# EAGLE design OpenBook (EAGLE 9.7.0)
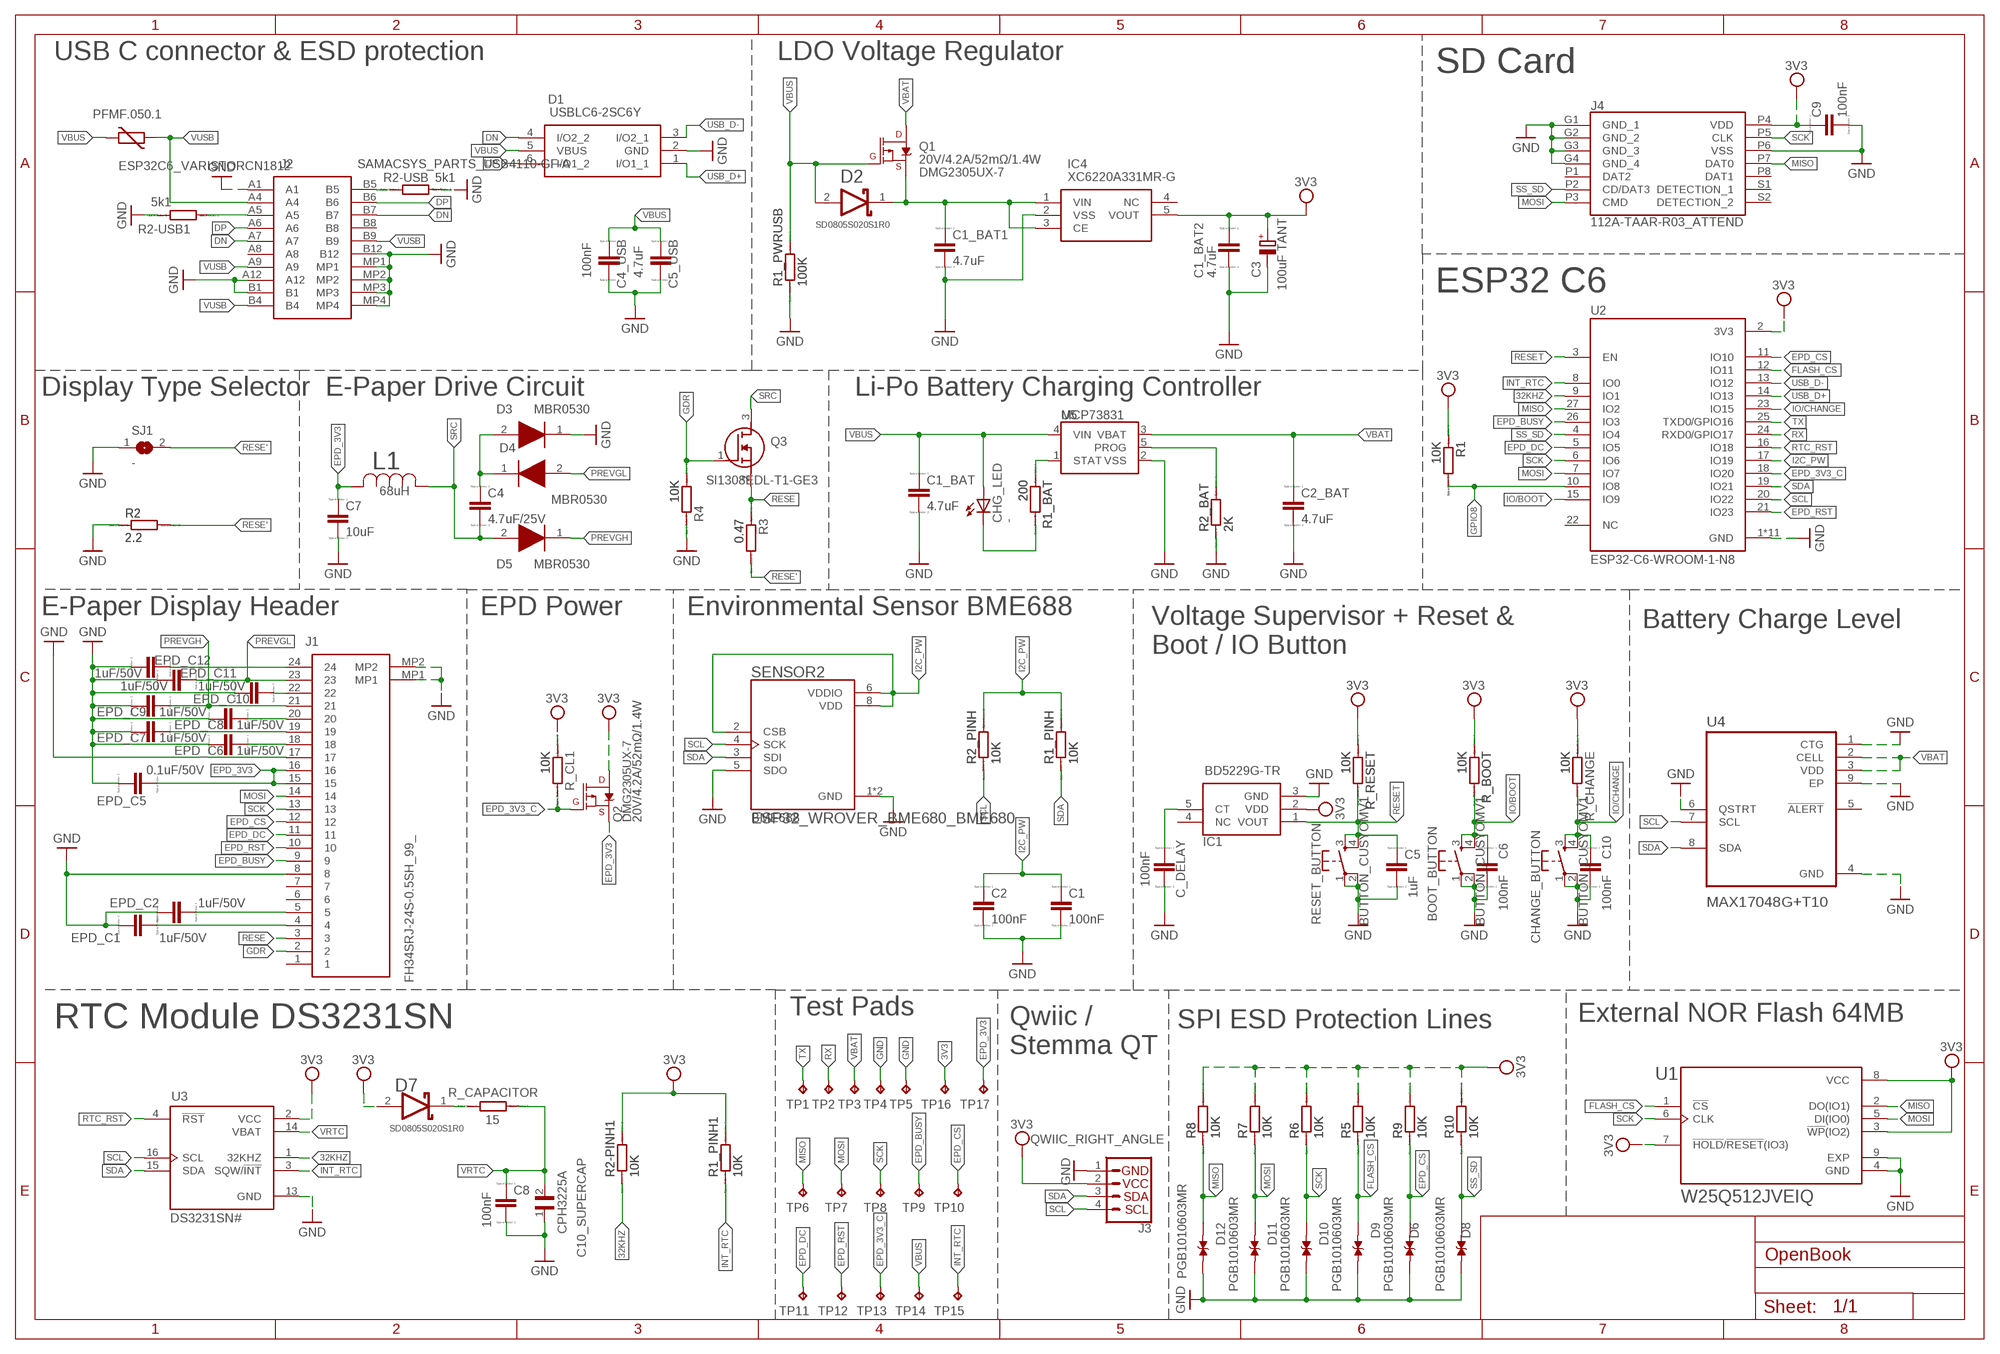
[diagram p0: schematic, sheet 1]

## Parts
BOOT_BUTTON  BUTTON_CUSYOMV1  [MYBUTTON]
C1  100nF  EAGLE-LTSPICE_CC0402  [EAGLE-LTSPICE_C0402]
C1_BAT  4.7uF  EAGLE-LTSPICE_CC0402  [EAGLE-LTSPICE_C0402]
C1_BAT1  4.7uF  EAGLE-LTSPICE_CC0402  [EAGLE-LTSPICE_C0402]
C1_BAT2  4.7uF  EAGLE-LTSPICE_CC0402  [EAGLE-LTSPICE_C0402]
C2  100nF  EAGLE-LTSPICE_CC0402  [EAGLE-LTSPICE_C0402]
C2_BAT  4.7uF  EAGLE-LTSPICE_CC0402  [EAGLE-LTSPICE_C0402]
C3  100uF TANT  RCL_CPOL-EUCT3528  [RCL_CT3528]
C4  4.7uF/25V  EAGLE-LTSPICE_CC0402  [EAGLE-LTSPICE_C0402]
C4_USB  100nF  EAGLE-LTSPICE_CC0402  [EAGLE-LTSPICE_C0402]
C5  1uF  EAGLE-LTSPICE_CC0402  [EAGLE-LTSPICE_C0402]
C5_USB  4.7uF  EAGLE-LTSPICE_CC0402  [EAGLE-LTSPICE_C0402]
C6  100nF  EAGLE-LTSPICE_CC0402  [EAGLE-LTSPICE_C0402]
C7  10uF  EAGLE-LTSPICE_CC0402  [EAGLE-LTSPICE_C0402]
C8  100nF  EAGLE-LTSPICE_CC0402  [EAGLE-LTSPICE_C0402]
C9  100nF  EAGLE-LTSPICE_CC0402  [EAGLE-LTSPICE_C0402]
C10  100nF  EAGLE-LTSPICE_CC0402  [EAGLE-LTSPICE_C0402]
C10_SUPERCAP  CPH3225A  [CAPCP3225X100N]
C_DELAY  100nF  EAGLE-LTSPICE_CC0402  [EAGLE-LTSPICE_C0402]
CHANGE_BUTTON  BUTTON_CUSYOMV1  [MYBUTTON]
CHG_LED  -  ADAFRUIT_LEDCHIP-LED0603  [ADAFRUIT_CHIP-LED0603]
D1  USBLC6-2SC6Y  [SOT95P280X145-6N]
D2  SD0805S020S1R0  ESP32_WROVER_AVX---SD0805S020S1R0_AVX_SD0805S020S1R0_0_0AVX_SD0805S020S1R0_0_0  [ESP32_WROVER_AVX---SD0805S020S1R0_AVX_SD0805S020S1R0_0]
D3  MBR0530  [SOD3716X135N]
D4  MBR0530  [SOD3716X135N]
D5  MBR0530  [SOD3716X135N]
D6  PGB1010603MR  [DIOC1608X36N]
D7  ESP32_WROVER_AVX---SD0805S020S1R0_AVX_SD0805S020S1R0_0_0AVX_SD0805S020S1R0_0_0  [ESP32_WROVER_AVX---SD0805S020S1R0_AVX_SD0805S020S1R0_0]
D8  PGB1010603MR  [DIOC1608X36N]
D9  PGB1010603MR  [DIOC1608X36N]
D10  PGB1010603MR  [DIOC1608X36N]
D11  PGB1010603MR  [DIOC1608X36N]
D12  PGB1010603MR  [DIOC1608X36N]
EPD_C1  1uF/50V  EAGLE-LTSPICE_CC0402  [EAGLE-LTSPICE_C0402]
EPD_C2  1uF/50V  EAGLE-LTSPICE_CC0402  [EAGLE-LTSPICE_C0402]
EPD_C5  0.1uF/50V  EAGLE-LTSPICE_CC0402  [EAGLE-LTSPICE_C0402]
EPD_C6  1uF/50V  EAGLE-LTSPICE_CC0402  [EAGLE-LTSPICE_C0402]
EPD_C7  1uF/50V  EAGLE-LTSPICE_CC0402  [EAGLE-LTSPICE_C0402]
EPD_C8  1uF/50V  EAGLE-LTSPICE_CC0402  [EAGLE-LTSPICE_C0402]
EPD_C9  1uF/50V  EAGLE-LTSPICE_CC0402  [EAGLE-LTSPICE_C0402]
EPD_C10  1uF/50V  EAGLE-LTSPICE_CC0402  [EAGLE-LTSPICE_C0402]
EPD_C11  1uF/50V  EAGLE-LTSPICE_CC0402  [EAGLE-LTSPICE_C0402]
EPD_C12  1uF/50V  EAGLE-LTSPICE_CC0402  [EAGLE-LTSPICE_C0402]
IC1  BD5229G-TR  [SOT95P280X125-5N]
IC4  XC6220A331MR-G  [SOT95P280X120-5N]
J1  FH34SRJ-24S-0.5SH_99_  [FH34SRJ24S05SH99]
J2  SAMACSYS_PARTS_USB4110-GF-A  [SAMACSYS_PARTS_USB4110GFA]
J3  QWIIC_RIGHT_ANGLE  QWIIC_CONNECTORJS-1MM  [JST04_1MM_RA]
J4  112A-TAAR-R03_ATTEND  [112ATAARR03ATTEND]
L1  68uH  744043680IND_4828-WE-TPC_WRE  [IND_4828-WE-TPC_WRE]
PFMF.050.1  ESP32C6_VARISTORCN1812  [ESP32C6_VARISTOR_CT/CN1812]
Q1  20V/4.2A/52mΩ/1.4W  ESP32_WROVER_SPARKFUN-DISCRETESEMI_MOSFET_PCH-DMG2305UX-7  [ESP32_WROVER_SPARKFUN-DISCRETESEMI_SOT23-3]
Q2  20V/4.2A/52mΩ/1.4W  ESP32_WROVER_SPARKFUN-DISCRETESEMI_MOSFET_PCH-DMG2305UX-7  [ESP32_WROVER_SPARKFUN-DISCRETESEMI_SOT23-3]
Q3  SI1308EDL-T1-GE3  [SOT65P210X110-3N]
R1  10K  ESP32_WROVER_EAGLE-LTSPICE_RR0402  [ESP32_WROVER_EAGLE-LTSPICE_R0402]
R1_BAT  200  ESP32_WROVER_EAGLE-LTSPICE_RR0402  [ESP32_WROVER_EAGLE-LTSPICE_R0402]
R1_PINH  10K  ESP32_WROVER_EAGLE-LTSPICE_RR0402  [ESP32_WROVER_EAGLE-LTSPICE_R0402]
R1_PINH1  10K  ESP32_WROVER_EAGLE-LTSPICE_RR0402  [ESP32_WROVER_EAGLE-LTSPICE_R0402]
R1_PWRUSB  100K  ESP32_WROVER_EAGLE-LTSPICE_RR0402  [ESP32_WROVER_EAGLE-LTSPICE_R0402]
R2  2.2  ESP32_WROVER_EAGLE-LTSPICE_RR0402  [ESP32_WROVER_EAGLE-LTSPICE_R0402]
R2-PINH1  10K  ESP32_WROVER_EAGLE-LTSPICE_RR0402  [ESP32_WROVER_EAGLE-LTSPICE_R0402]
R2-USB  5k1  ESP32_WROVER_EAGLE-LTSPICE_RR0402  [ESP32_WROVER_EAGLE-LTSPICE_R0402]
R2-USB1  5k1  ESP32_WROVER_EAGLE-LTSPICE_RR0402  [ESP32_WROVER_EAGLE-LTSPICE_R0402]
R2_BAT  2K  ESP32_WROVER_EAGLE-LTSPICE_RR0402  [ESP32_WROVER_EAGLE-LTSPICE_R0402]
R2_PINH  10K  ESP32_WROVER_EAGLE-LTSPICE_RR0402  [ESP32_WROVER_EAGLE-LTSPICE_R0402]
R3  0.47  ESP32_WROVER_EAGLE-LTSPICE_RR0402  [ESP32_WROVER_EAGLE-LTSPICE_R0402]
R4  10K  ESP32_WROVER_EAGLE-LTSPICE_RR0402  [ESP32_WROVER_EAGLE-LTSPICE_R0402]
R5  10K  ESP32_WROVER_EAGLE-LTSPICE_RR0402  [ESP32_WROVER_EAGLE-LTSPICE_R0402]
R6  10K  ESP32_WROVER_EAGLE-LTSPICE_RR0402  [ESP32_WROVER_EAGLE-LTSPICE_R0402]
R7  10K  ESP32_WROVER_EAGLE-LTSPICE_RR0402  [ESP32_WROVER_EAGLE-LTSPICE_R0402]
R8  10K  ESP32_WROVER_EAGLE-LTSPICE_RR0402  [ESP32_WROVER_EAGLE-LTSPICE_R0402]
R9  10K  ESP32_WROVER_EAGLE-LTSPICE_RR0402  [ESP32_WROVER_EAGLE-LTSPICE_R0402]
R10  10K  ESP32_WROVER_EAGLE-LTSPICE_RR0402  [ESP32_WROVER_EAGLE-LTSPICE_R0402]
R_BOOT  10K  ESP32_WROVER_EAGLE-LTSPICE_RR0402  [ESP32_WROVER_EAGLE-LTSPICE_R0402]
R_CAPACITOR  15  ESP32_WROVER_EAGLE-LTSPICE_RR0402  [ESP32_WROVER_EAGLE-LTSPICE_R0402]
R_CHANGE  10K  ESP32_WROVER_EAGLE-LTSPICE_RR0402  [ESP32_WROVER_EAGLE-LTSPICE_R0402]
R_CL1  10K  ESP32_WROVER_EAGLE-LTSPICE_RR0402  [ESP32_WROVER_EAGLE-LTSPICE_R0402]
R_RESET  10K  ESP32_WROVER_EAGLE-LTSPICE_RR0402  [ESP32_WROVER_EAGLE-LTSPICE_R0402]
RESET_BUTTON  BUTTON_CUSYOMV1  [MYBUTTON]
SENSOR2  ESP32_WROVER_BME680_BME680  [ESP32_WROVER_BME680_PSON80P300X300X100-8N]
SJ1  -  SJ  [SJ]
TP1  TPTP20R  [TP20R]
TP2  TPTP20R  [TP20R]
TP3  TPTP20R  [TP20R]
TP4  TPTP20R  [TP20R]
TP5  TPTP20R  [TP20R]
TP6  TPTP20R  [TP20R]
TP7  TPTP20R  [TP20R]
TP8  TPTP20R  [TP20R]
TP9  TPTP20R  [TP20R]
TP10  TPTP20R  [TP20R]
TP11  TPTP20R  [TP20R]
TP12  TPTP20R  [TP20R]
TP13  TPTP20R  [TP20R]
TP14  TPTP20R  [TP20R]
TP15  TPTP20R  [TP20R]
TP16  TPTP20R  [TP20R]
TP17  TPTP20R  [TP20R]
U1  W25Q512JVEIQ  [SON127P600X800X80-9N]
U2  ESP32-C6-WROOM-1-N8  [XCVR_ESP32-C6-WROOM-1-N8]
U3  DS3231SN#  [SOIC127P1032X265-16N]
U4  MAX17048G+T10  [SON50P200X200X80-9N]
U5  MCP73831  ESP32_WROVER_SPARKFUN-IC-POWER_MCP73831  [ESP32_WROVER_SPARKFUN-IC-POWER_SOT23-5]

## Nets
3V3 [Power]: C1_BAT2.1 C3.+ C9.1 D7.2(ANODE) IC1.2(VDD) IC4.5(VOUT) J3.2 J4.P4(VDD) Q2.3(D) R1.1 R1_PINH1.2 R2-PINH1.2 R5.2 R6.2 R7.2 R8.2 R9.2 R10.2 R_BOOT.1 R_CHANGE.1 R_CL1.1 R_RESET.1 TP16.TP U1.3(!WP!(IO2)) U1.7(!HOLD!/!RESET!(IO3)) U1.8(VCC) U2.2(3V3) U3.2(VCC)
32KHZ: R2-PINH1.1 U2.9(IO1) U3.1(32KHZ)
DN: D1.4(I/O2_2) J2.A7 J2.B7
DP: D1.6(I/O1_2) J2.A6 J2.B6
EPD_3V3 [Power]: C7.1 EPD_C5.1 J1.15 J1.16 L1.2 Q2.2(S) TP17.TP
EPD_3V3_C [Power]: Q2.1(G) R_CL1.2 TP13.TP U2.18(IO20)
EPD_BUSY: J1.9 TP9.TP U2.26(IO3)
EPD_CS: D6.1 J1.12 R9.1 TP10.TP U2.11(IO10)
EPD_DC: J1.11 TP11.TP U2.5(IO5)
EPD_RST: J1.10 TP12.TP U2.21(IO23)
FLASH_CS: D9.1 R5.1 U1.1(!CS) U2.12(IO11)
GDR: J1.2 Q3.1(G) R4.1
GND: BOOT_BUTTON.1 BOOT_BUTTON.2 C1.2 C1_BAT1.2 C1_BAT2.2 C1_BAT.2 C2.2 C2_BAT.2 C3.- C4_USB.2 C5.2 C5_USB.2 C6.2 C7.2 C8.2 C9.2 C10.2 C10_SUPERCAP.1 C_DELAY.2 CHANGE_BUTTON.1 CHANGE_BUTTON.2 D1.2(GND) D3.1(K) D6.2 D8.2 D9.2 D10.2 D11.2 D12.2 EPD_C1.2 EPD_C2.2 EPD_C5.2 EPD_C6.2 EPD_C7.2 EPD_C8.2 EPD_C9.2 EPD_C10.2 EPD_C11.2 EPD_C12.2 IC1.3(GND) IC4.2(VSS) J1.8 J1.17 J1.MP1 J1.MP2 J2.A1 J2.A12 J2.B1 J2.B12 J2.MP1 J2.MP2 J2.MP3 J2.MP4 J3.1 J4.G1(GND_1) J4.G2(GND_2) J4.G3(GND_3) J4.G4(GND_4) J4.P6(VSS) R1_PWRUSB.1 R2-USB1.1 R2-USB.2 R2.1 R2_BAT.1 R4.2 RESET_BUTTON.1 RESET_BUTTON.2 SENSOR2.1(GND) SENSOR2.5(SDO) SENSOR2.7(GND) SJ1.1 TP4.TP TP5.TP U1.4(GND) U1.9(EXP) U2.1(GND) U2.28(GND) U2.29_1(GND) U2.29_2(GND) U2.29_3(GND) U2.29_4(GND) U2.29_5(GND) U2.29_6(GND) U2.29_7(GND) U2.29_8(GND) U2.29_9(GND) U3.13(GND) U4.1(CTG) U4.4(GND) U4.6(QSTRT) U4.9(EP) U5.2(VSS)
GPIO8: R1.2 U2.10(IO8)
I2C_PW: C1.1 C2.1 R1_PINH.2 R2_PINH.2 SENSOR2.2(CSB) SENSOR2.6(VDDIO) SENSOR2.8(VDD) U2.17(IO19)
INT_RTC: R1_PINH1.1 TP15.TP U2.8(IO0) U3.3(SQW/!INT)
IO/BOOT: BOOT_BUTTON.3 BOOT_BUTTON.4 C6.1 R_BOOT.2 U2.15(IO9)
IO/CHANGE: C10.1 CHANGE_BUTTON.3 CHANGE_BUTTON.4 R_CHANGE.2 U2.23(IO15)
MISO: D12.1 J4.P7(DAT0) R8.1 TP6.TP U1.2(DO(IO1)) U2.27(IO2)
MOSI: D11.1 J1.14 J4.P3(CMD) R7.1 TP7.TP U1.5(DI(IO0)) U2.7(IO7)
N$1: EPD_C2.1 J1.5
N$2: D7.1(CATHODE) R_CAPACITOR.2
N$3: C_DELAY.1 IC1.5(CT)
N$4: EPD_C1.1 J1.4
N$5: EPD_C6.1 J1.18
N$6: EPD_C7.1 J1.19
N$8: EPD_C8.1 J1.20
N$9: C4.1 D3.2(A) D4.1(K)
N$10: EPD_C10.1 J1.22
N$11: R2_BAT.2 U5.5(PROG)
N$12: EPD_C12.1 J1.24
N$13: R1_BAT.1 U5.1(STAT)
N$14: CHG_LED.C R1_BAT.2
N$15: C1_BAT1.1 D2.1(CATHODE) IC4.1(VIN) IC4.3(CE) Q1.2(S)
N$16: J2.B5 R2-USB.1
N$17: J2.A5 R2-USB1.2
PREVGH: D5.1(K) EPD_C9.1 J1.21
PREVGL: D4.2(A) EPD_C11.1 J1.23
RESE: J1.3 Q3.2(S) R3.1
RESE': R2.2 R3.2 SJ1.2
RESET: C5.1 IC1.1(VOUT) R_RESET.2 RESET_BUTTON.3 RESET_BUTTON.4 U2.3(EN)
RTC_RST: U2.16(IO18) U3.4(!RST)
RX: TP2.TP U2.24(RXD0/GPIO17)
SCK: D10.1 J1.13 J4.P5(CLK) R6.1 TP8.TP U1.6(CLK) U2.6(IO6)
SCL: J3.4 R2_PINH.1 SENSOR2.4(SCK) U2.20(IO22) U3.16(SCL) U4.7(SCL)
SDA: J3.3 R1_PINH.1 SENSOR2.3(SDI) U2.19(IO21) U3.15(SDA) U4.8(SDA)
SRC: C4.2 D5.2(A) L1.1 Q3.3(D)
SS_SD: D8.1 J4.P2(CD/DAT3) R10.1 U2.4(IO4)
TX: TP1.TP U2.25(TXD0/GPIO16)
USB_D+: D1.1(I/O1_1) U2.14(IO13)
USB_D-: D1.3(I/O2_1) U2.13(IO12)
VBAT [Power]: C2_BAT.1 Q1.3(D) TP3.TP U4.2(CELL) U4.3(VDD) U5.3(VBAT)
VBUS [Power]: C1_BAT.1 C4_USB.1 C5_USB.1 CHG_LED.A D1.5(VBUS) D2.2(ANODE) PFMF.050.1.2 Q1.1(G) R1_PWRUSB.2 TP14.TP U5.4(VIN)
VRTC [Power]: C8.1 C10_SUPERCAP.2 R_CAPACITOR.1 U3.14(VBAT)
VUSB [Power]: J2.A4 J2.A9 J2.B4 J2.B9 PFMF.050.1.1
Unconnected: IC1.4(NC) IC4.4(NC) J1.1 J1.6 J1.7 J2.A8 J2.B8 J4.P1(DAT2) J4.P8(DAT1) J4.S1(DETECTION_1) J4.S2(DETECTION_2) U2.22(NC) U4.5(!ALERT)

## Notes on the sheet
- USB C connector & ESD protection | LDO Voltage Regulator
- SD Card
- ESP32 C6
- Display Type Selector | E-Paper Drive Circuit | Li-Po Battery Charging Controller
- E-Paper Display Header | EPD Power | Environmental Sensor BME688
- Battery Charge Level
- Voltage Supervisor + Reset &
  Boot / IO Button
- Test Pads | External NOR Flash 64MB
- SPI ESD Protection Lines
- Qwiic / 
  Stemma QT
- RTC Module DS3231SN

## Library data of the parts
BOOT_BUTTON CHANGE_BUTTON RESET_BUTTON = DeskAssistant v19 v1:BUTTON_CUSYOMV1
C1 C1_BAT C1_BAT1 C1_BAT2 C2 C2_BAT C4 C4_USB C5 C5_USB C6-C10 C_DELAY EPD_C1 EPD_C2 EPD_C5-EPD_C12 = DeskAssistant v19 v1:EAGLE-LTSPICE_C: CAPACITOR, European symbol; SPICEMODEL: NONE; SPICEPREFIX: C
C3 = DeskAssistant v19 v1:RCL_CPOL-EU: POLARIZED CAPACITOR, European symbol; SPICEPREFIX: C
C10_SUPERCAP = DeskAssistant v19 v1:CPH3225A: Cap 0.011F 3.3V 1210 Flat Check availability <https://pricing.snapeda.com/parts/CPH3225A/Seiko%20Instruments/view-part?ref=eda>; AVAILABILITY: Not in stock; CHECK_PRICES: https://www.snapeda.com/parts/CPH3225A/Seiko+Instruments/view-part/?ref=eda; DESCRIPTION: 11 mF (EDLC) Supercapacitor 3.3 V 1210 (3225 Metric) - -; MF: Seiko Instruments; MP: CPH3225A; PACKAGE: 1210 Seiko; PRICE: None; PURCHASE-URL: https://www.snapeda.com/api/url_track_click_mouser/?unipart_id=562593&manufacturer=Seiko Instruments&part_name=CPH3225A&search_term=None; SNAPEDA_LINK: https://www.snapeda.com/parts/CPH3225A/Seiko+Instruments/view-part/?ref=snap
CHG_LED = DeskAssistant v19 v1:ADAFRUIT_LED: LED OSRAM: - CHIPLED LG R971, LG N971, LY N971, LG Q971, LY Q971, LO R971, LY R971 LH N974, LH R974 LS Q976, LO Q976, LY Q976 LO Q996 - Hyper CHIPLED LW Q18S LB Q993, LB Q99A, LB R99A - SideLED LS A670, LO A670, LY A670, LG A670, LP A670 LB A673, LV A673, LT A673, LW A673 LH A674 LY A675 LS A676, LA A676, LO A676, LY A676, LW A676 LS A679, LY A679, LG A679 - Hyper Micro SIDELED® LS Y876, LA Y876, LO Y876, LY Y876 LT Y87S - SmartLED LW L88C, LW L88S LB L89C, LB L89S, LG L890 LS L89K, LO L89K, LY L89K LS L896, LA L896, LO L896, LY L896 - TOPLED LS T670, LO T670, LY T670, LG T670, LP T670 LSG T670, LSP T670, LSY T670, LOP T670, LYG T670 LG T671, LOG T671, LSG T671 LB T673, LV T673, LT T673, LW T673 LH T674 LS T676, LA T676, LO T676, LY T676, LB T676, LH T676, LSB T676, LW T676 LB T67C, LV T67C, LT T67C, LS T67K, LO T67K, LY T67K, LW E67C LS E67B, LA E67B, LO E67B, LY E67B, LB E67C, LV E67C, LT E67C LW T67C LS T679, LY T679, LG T679 LS T770, LO T770, LY T770, LG T770, LP T770 LB T773, LV T773, LT T773, LW T773 LH T774 LS E675, LA E675, LY E675, LS T675 LS T776, LA T776, LO T776, LY T776, LB T776 LHGB T686 LT T68C, LB T68C - Hyper Mini TOPLED® LB M676 - Mini TOPLED Santana® LG M470 LS M47K, LO M47K, LY M47K Source: http://www.osram.convergy.de/
D1 = DeskAssistant v19 v1:USBLC6-2SC6Y: Low Cap. ESD Protection Auto SOT-23-6 STMicroelectronics USBLC6-2SC6Y, Dual Uni-Directional TVS Diode Array, 6-Pin SOT-23 Source: Datasheet <https://componentsearchengine.com/Datasheets/1/USBLC6-2SC6Y.pdf> Check availability <https://pricing.snapeda.com/parts/USBLC6-2SC6Y/STMicroelectronics/view-part?ref=eda>; AVAILABILITY: In Stock; CHECK_PRICES: https://www.snapeda.com/parts/USBLC6-2SC6Y/STMicroelectronics/view-part/?ref=eda; DESCRIPTION: 17V Clamp 5A (8/20µs) Ipp Tvs Diode Surface Mount SOT-23-6; MF: STMicroelectronics; MP: USBLC6-2SC6Y; PACKAGE: SOT-23-6 STMicroelectronics; PRICE: None; SNAPEDA_LINK: https://www.snapeda.com/parts/USBLC6-2SC6Y/STMicroelectronics/view-part/?ref=snap
D2 D7 = DeskAssistant v19 v1:ESP32_WROVER_AVX---SD0805S020S1R0_AVX_SD0805S020S1R0_0_0: Schottky Barrier Rectifier Diode; CENTROID_NOT_SPECIFIED: No; DATASHEET: http://datasheets.avx.com/schottky.pdf; DIGIKEY_DESCRIPTION: DIODE SCHOTTKY 20V 1A 0805; DIGIKEY_PART_NUMBER: 478-7800-1-ND; LEAD_FREE: yes; MF: AVX; MOUSER_PART_NUMBER: 581-SD0805S020S1R0; PACKAGE: 0805 (2012 metric); PREFIX: D; ROHS: yes; TEMPERATURE_RANGE_HIGH: +125°C; TEMPERATURE_RANGE_LOW: -55°C; VALUE_COPY: SD0805S020S1R0
D3-D5 = DeskAssistant v19 v1:MBR0530: ON SEMICONDUCTOR - MBR0530 - DIODE, SCHOTTKY, 0.5A, 30V, SOD-123 Source: Datasheet <http://www.onsemi.com/pub/Collateral/MBR0530T1-D.PDF> Check availability <https://pricing.snapeda.com/parts/MBR0530/ON%20Semiconductor/view-part?ref=eda>; AVAILABILITY: In Stock; CHECK_PRICES: https://www.snapeda.com/parts/MBR0530/Onsemi/view-part/?ref=eda; DESCRIPTION: Diode Schottky 30 V 500mA Surface Mount SOD-123; MF: ON Semiconductor; MP: MBR0530; PACKAGE: SOD-123-2 ON Semiconductor; PRICE: None; PURCHASE-URL: https://www.snapeda.com/api/url_track_click_mouser/?unipart_id=179458&manufacturer=ON Semiconductor&part_name=MBR0530&search_term=None; SNAPEDA_LINK: https://www.snapeda.com/parts/MBR0530/Onsemi/view-part/?ref=snap
D6 D8-D12 = DeskAssistant v19 v1:PGB1010603MR: Check availability <https://pricing.snapeda.com/parts/PGB1010603MR/Littelfuse%20Inc./view-part?ref=eda>; AVAILABILITY: In Stock; CHECK_PRICES: https://www.snapeda.com/parts/PGB1010603MR/Littelfuse/view-part/?ref=eda; DESCRIPTION: 150V (Typ) Clamp - Ipp Tvs Diode Surface Mount 0603 (1608 Metric); MF: Littelfuse Inc.; MP: PGB1010603MR; PACKAGE: 0603 Littelfuse Inc.; PRICE: None; PURCHASE-URL: https://www.snapeda.com/api/url_track_click_mouser/?unipart_id=5659453&manufacturer=Littelfuse Inc.&part_name=PGB1010603MR&search_term=None; SNAPEDA_LINK: https://www.snapeda.com/parts/PGB1010603MR/Littelfuse/view-part/?ref=snap
IC1 = DeskAssistant v19 v1:BD5229G-TR: Voltage Detector with Adjustable Delay Time: CMOS processes are utilized to develop high precision, low current consumption CMOS reset ICs that allow arbitrary setting of the delay time. The extensive lineup includes both Nch Open Drain and CMOS output types in a wide range of detection voltages (from 2.3V to 6.0V, in 0.1V steps), enabling selection of the ideal solution based on customer requirements. In addition, the entire series is of course both lead-free and RoHS-compliant. Source: Datasheet <https://datasheet.datasheetarchive.com/originals/distributors/Datasheets_SAMA/f2b9741ef86007909f138d561a359946.pdf>; DESCRIPTION: Voltage Detector with Adjustable Delay Time: CMOS processes are utilized to develop high precision, low current consumption CMOS reset ICs that allow arbitrary setting of the delay time. The extensive lineup includes both Nch Open Drain and CMOS output types in a wide range of detection voltages (from 2.3V to 6.0V, in 0.1V steps), enabling selection of the ideal solution based on customer requirements. In addition, the entire series is of course both lead-free and RoHS-compliant.; HEIGHT: 1.25mm; MANUFACTURER_NAME: ROHM Semiconductor; MANUFACTURER_PART_NUMBER: BD5229G-TR; MOUSER_PART_NUMBER: 755-BD5229G-TR; MOUSER_PRICE-STOCK: https://www.mouser.co.uk/ProductDetail/ROHM-Semiconductor/BD5229G-TR?qs=4kLU8WoGk0vvnhrrYwdszw%3D%3D
IC4 = DeskAssistant v19 v1:XC6220A331MR-G: LDO Voltage Regulators Source: Datasheet <https://www.torexsemi.com/file/xc6220/XC6220.pdf>; DESCRIPTION: LDO Voltage Regulators; HEIGHT: 1.2mm; MANUFACTURER_NAME: Torex; MANUFACTURER_PART_NUMBER: XC6220A331MR-G; MOUSER_PART_NUMBER: 865-XC6220A331MR-G; MOUSER_PRICE-STOCK: https://www.mouser.co.uk/ProductDetail/Torex-Semiconductor/XC6220A331MR-G?qs=AsjdqWjXhJ8ZSWznL1J0gg%3D%3D
J1 = DeskAssistant v19 v1:FH34SRJ-24S-0.5SH_99_: 24 Position FFC, FPC Connector Contacts, Top and Bottom 0.020" (0.50mm) Surface Mount, Right Angle Source: Datasheet <https://www.hirose.com/en/product/document?clcode=CL0580-1255-6-99&productname=FH34SRJ-24S-0.5SH(99)&series=FH34SRJ&documenttype=2DDrawing&lang=en&documentid=0000990903>; DESCRIPTION: 24 Position FFC, FPC Connector Contacts, Top and Bottom 0.020" (0.50mm) Surface Mount, Right Angle; HEIGHT: 1.1mm; MANUFACTURER_NAME: Hirose; MANUFACTURER_PART_NUMBER: FH34SRJ-24S-0.5SH(99); MOUSER_PART_NUMBER: 798-FH34SRJ24S05SH99; MOUSER_PRICE-STOCK: https://www.mouser.co.uk/ProductDetail/Hirose-Connector/FH34SRJ-24S-0.5SH99?qs=vcbW%252B4%252BSTIpKBl5ap9J8Fw%3D%3D
J2 = DeskAssistant v19 v1:SAMACSYS_PARTS_USB4110-GF-A: CONN USB 2.0 TYPE-C R/A SMT Source: Datasheet <https://gct.co/files/drawings/usb4110.pdf>; DESCRIPTION: CONN USB 2.0 TYPE-C R/A SMT; HEIGHT: 3.26mm; MANUFACTURER_NAME: GCT (GLOBAL CONNECTOR TECHNOLOGY); MANUFACTURER_PART_NUMBER: USB4110-GF-A; MOUSER_PART_NUMBER: 640-USB4110-GF-A; MOUSER_PRICE-STOCK: https://www.mouser.co.uk/ProductDetail/GCT/USB4110-GF-A?qs=KUoIvG%2F9IlYiZvIXQjyJeA%3D%3D
J3 = DeskAssistant v19 v1:QWIIC_CONNECTOR: SparkFun I2C Standard Qwiic Connector An SMD 1mm pitch JST connector makes it easy and quick (get it? Qwiic?) to connect I2C devices to each other. The Qwiic system <http://www.sparkfun.com/qwiic> enables fast and solderless connection between popular platforms and various sensors and actuators. We carry 200mm <https://www.sparkfun.com/products/14204>, 100mm <https://www.sparkfun.com/products/14205>, 50mm <https://www.sparkfun.com/products/14206>, and breadboard friendly <https://www.sparkfun.com/products/14207> Qwiic cables. We also offer 10 pcs strips <https://www.sparkfun.com/products/14323> the SMD connectors.; PROD_ID: CONN-13694
J4 = DeskAssistant v19 v1:112A-TAAR-R03_ATTEND: Micro SD Card Socket, Push-Push Type, Top Mount, SMT, H=1.83mm, 10u Source: Datasheet <https://www.attend.com.tw/data/download/file/112A-TAAR-R03.pdf>; DESCRIPTION: Micro SD Card Socket, Push-Push Type, Top Mount, SMT, H=1.83mm, 10u; HEIGHT: 1.9mm; MANUFACTURER_NAME: ATTEND; MANUFACTURER_PART_NUMBER: 112A-TAAR-R03 ATTEND
L1 = DeskAssistant v19 v1:744043680; COPYRIGHT: Copyright (C) 2024 Ultra Librarian. All rights reserved.; MANUFACTURER_PART_NUMBER: 744043680; MFR_NAME: Wurth Electronics
PFMF.050.1 = DeskAssistant v19 v1:ESP32C6_VARISTOR: VARISTOR
Q1 = DeskAssistant v19 v1:ESP32_WROVER_SPARKFUN-DISCRETESEMI_MOSFET_PCH: P-channel MOSFETs Voltage controlled devices that allow control of high current outputs. SparkFun Products: SparkFun ESP32 Thing <https://www.sparkfun.com/products/13907> SparkFun ESP8266 Thing <https://www.sparkfun.com/products/13231> SparkFun Pi Servo HAT V2 <https://www.sparkfun.com/products/15316> DMG2305UX-7 (20V/4.2A/SOT23-3); COMP_NAME: DMG2305UX-7; PROD_ID: TRAN-14388
Q2 = DeskAssistant v19 v1:ESP32_WROVER_SPARKFUN-DISCRETESEMI_MOSFET_PCH: P-channel MOSFETs Voltage controlled devices that allow control of high current outputs. SparkFun Products: SparkFun ESP32 Thing <https://www.sparkfun.com/products/13907> SparkFun ESP8266 Thing <https://www.sparkfun.com/products/13231> SparkFun Pi Servo HAT V2 <https://www.sparkfun.com/products/15316> DMG2305UX-7 (20V/4.2A/SOT23-3); MP: DMG2305UX-7; PROD_ID: TRAN-14388
Q3 = DeskAssistant v19 v1:SI1308EDL-T1-GE3: MOSFET N-Ch 30V 1.5A TrenchFET SC70 Vishay Si1308EDL-T1-GE3 N-channel MOSFET Transistor, 1.5 A, 30 V, 3-Pin SC-70 Source: Datasheet <https://componentsearchengine.com/Datasheets/1/SI1308EDL-T1-GE3.pdf> Check availability <https://pricing.snapeda.com/parts/SI1308EDL-T1-GE3/Vishay%20Siliconix/view-part?ref=eda>; AVAILABILITY: In Stock; CHECK_PRICES: https://www.snapeda.com/parts/SI1308EDL-T1-GE3/Vishay+Siliconix/view-part/?ref=eda; DESCRIPTION: Si1308EDL-T1-GE3 N-channel MOSFET Transistor, 1.5 A, 30 V, 3-Pin SC-70 | Siliconix / Vishay SI1308EDL-T1-GE3; MF: Vishay Siliconix; MP: SI1308EDL-T1-GE3; PACKAGE: SOT-323 Vishay Semiconductor; PRICE: None; PURCHASE-URL: https://www.snapeda.com/api/url_track_click_mouser/?unipart_id=274603&manufacturer=Vishay Siliconix&part_name=SI1308EDL-T1-GE3&search_term=None; SNAPEDA_LINK: https://www.snapeda.com/parts/SI1308EDL-T1-GE3/Vishay+Siliconix/view-part/?ref=snap
R1 R1_BAT R1_PINH R1_PINH1 R1_PWRUSB R2 R2-PINH1 R2-USB R2-USB1 R2_BAT R2_PINH R3-R10 R_BOOT R_CAPACITOR R_CHANGE R_CL1 R_RESET = DeskAssistant v19 v1:ESP32_WROVER_EAGLE-LTSPICE_R: RESISTOR, European symbol; SPICEMODEL: NONE; SPICEPREFIX: R
SENSOR2 = DeskAssistant v19 v1:ESP32_WROVER_BME680_BME680: Integrated Environmental Unit; AVAILABILITY: Unavailable; DESCRIPTION: Integrated Environmental Unit; MF: Bosch Sensortec; MP: BME680; NEW_MP: BME688; PACKAGE: LGA-8 Bosch Tools; PRICE: None
SJ1 = DeskAssistant v19 v1:SJ: SMD solder JUMPER
TP1-TP17 = DeskAssistant v19 v1:TP: Test pad
U1 = DeskAssistant v19 v1:W25Q512JVEIQ: Check availability <https://pricing.snapeda.com/parts/W25Q512JVEIQ/Winbond%20Electronics/view-part?ref=eda>; AVAILABILITY: In Stock; CHECK_PRICES: https://www.snapeda.com/parts/W25Q512JVEIQ/Winbond+Electronics/view-part/?ref=eda; DESCRIPTION: FLASH - NOR Memory IC 512Mb (64M x 8) SPI - Quad I/O 133 MHz 8-WSON (8x6); MF: Winbond Electronics; MP: W25Q512JVEIQ; PACKAGE: Package; PRICE: None; SNAPEDA_LINK: https://www.snapeda.com/parts/W25Q512JVEIQ/Winbond+Electronics/view-part/?ref=snap
U2 = DeskAssistant v19 v1:ESP32-C6-WROOM-1-N8: Check availability <https://pricing.snapeda.com/parts/ESP32-C6-WROOM-1-N8/Espressif%20Systems/view-part?ref=eda>; AVAILABILITY: In Stock; CHECK_PRICES: https://www.snapeda.com/parts/ESP32-C6-WROOM-1-N8/Espressif+Systems/view-part/?ref=eda; DESCRIPTION: Multiprotocol Modules ESP32-C6 module, Wi-Fi 6 in 2.4 GHz band, Bluetooth 5, Zigbee 3.0 and Thread. ESP34-WROOM Compatible - ENGINEERING SAMPLE; MF: Espressif Systems; MP: ESP32-C6-WROOM-1-N8; PACKAGE: None; PRICE: None; SNAPEDA_LINK: https://www.snapeda.com/parts/ESP32-C6-WROOM-1-N8/Espressif+Systems/view-part/?ref=snap
U3 = DeskAssistant v19 v1:DS3231SN#: Real Time Clock Serial 16-Pin SOIC W T/R Check availability <https://pricing.snapeda.com/parts/DS3231SN%23/Analog%20Devices/view-part?ref=eda>; AVAILABILITY: In Stock; CHECK_PRICES: https://www.snapeda.com/parts/DS3231SN%23/Analog+Devices/view-part/?ref=eda; DESCRIPTION: Extremely Accurate I²C-Integrated RTC/TCXO/Crystal; MF: Analog Devices; MP: DS3231SN#; PACKAGE: SOIC-16 Maxim; PRICE: None; PURCHASE-URL: https://www.snapeda.com/api/url_track_click_mouser/?unipart_id=99048&manufacturer=Analog Devices&part_name=DS3231SN#&search_term=None; SNAPEDA_LINK: https://www.snapeda.com/parts/DS3231SN%23/Analog+Devices/view-part/?ref=snap
U4 = DeskAssistant v19 v1:MAX17048G+T10: Check availability <https://pricing.snapeda.com/parts/MAX17048G%2BT10/Analog%20Devices/view-part?ref=eda>; AVAILABILITY: In Stock; CHECK_PRICES: https://www.snapeda.com/parts/MAX17048G+T10/Analog+Devices/view-part/?ref=eda; DESCRIPTION: 3µA 1-Cell/2-Cell Fuel Gauge with ModelGauge; MF: Analog Devices; MP: MAX17048G+T10; PACKAGE: TDFN-8 Maxim; PRICE: None; PURCHASE-URL: https://www.snapeda.com/api/url_track_click_mouser/?unipart_id=329239&manufacturer=Analog Devices&part_name=MAX17048G+T10&search_term=None; SNAPEDA_LINK: https://www.snapeda.com/parts/MAX17048G+T10/Analog+Devices/view-part/?ref=snap
U5 = DeskAssistant v19 v1:ESP32_WROVER_SPARKFUN-IC-POWER_MCP73831: MCP73831T Li-Ion, Li-Pol Controller Miniature single cell, fully integrated Li-Ion, Li-polymer charge management controller Datasheet <http://ww1.microchip.com/downloads/en/DeviceDoc/20001984g.pdf> SparkFun Products: SparkFun ESP32 Thing <https://www.sparkfun.com/products/13907> SparkFun 9DoF Razor IMU M0 <https://www.sparkfun.com/products/14001>; PROD_ID: IC-09995

## Board
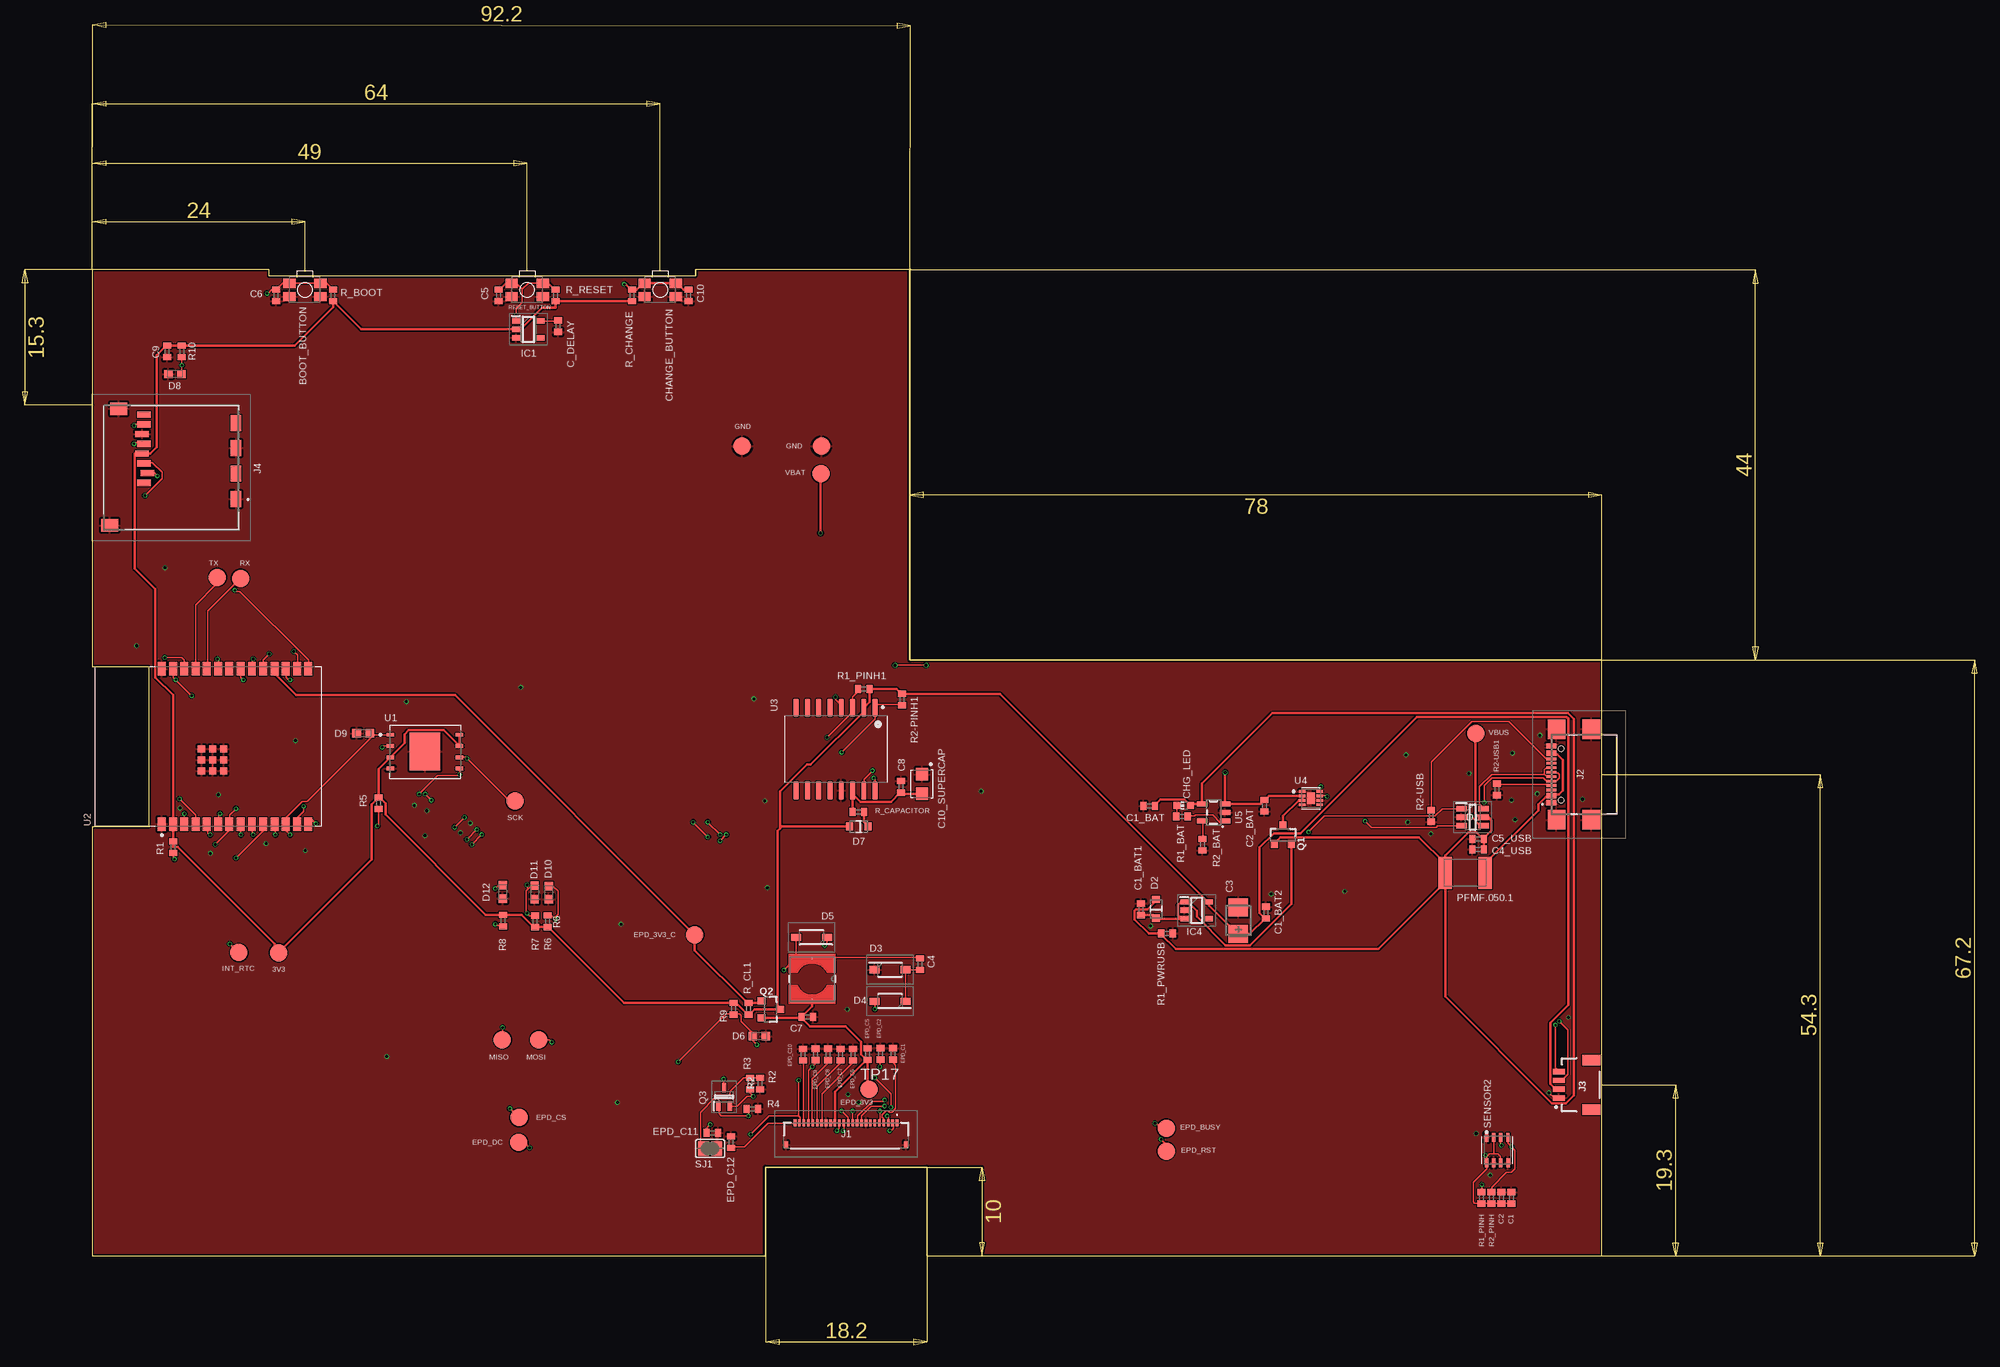
[diagram p1: board, top side]
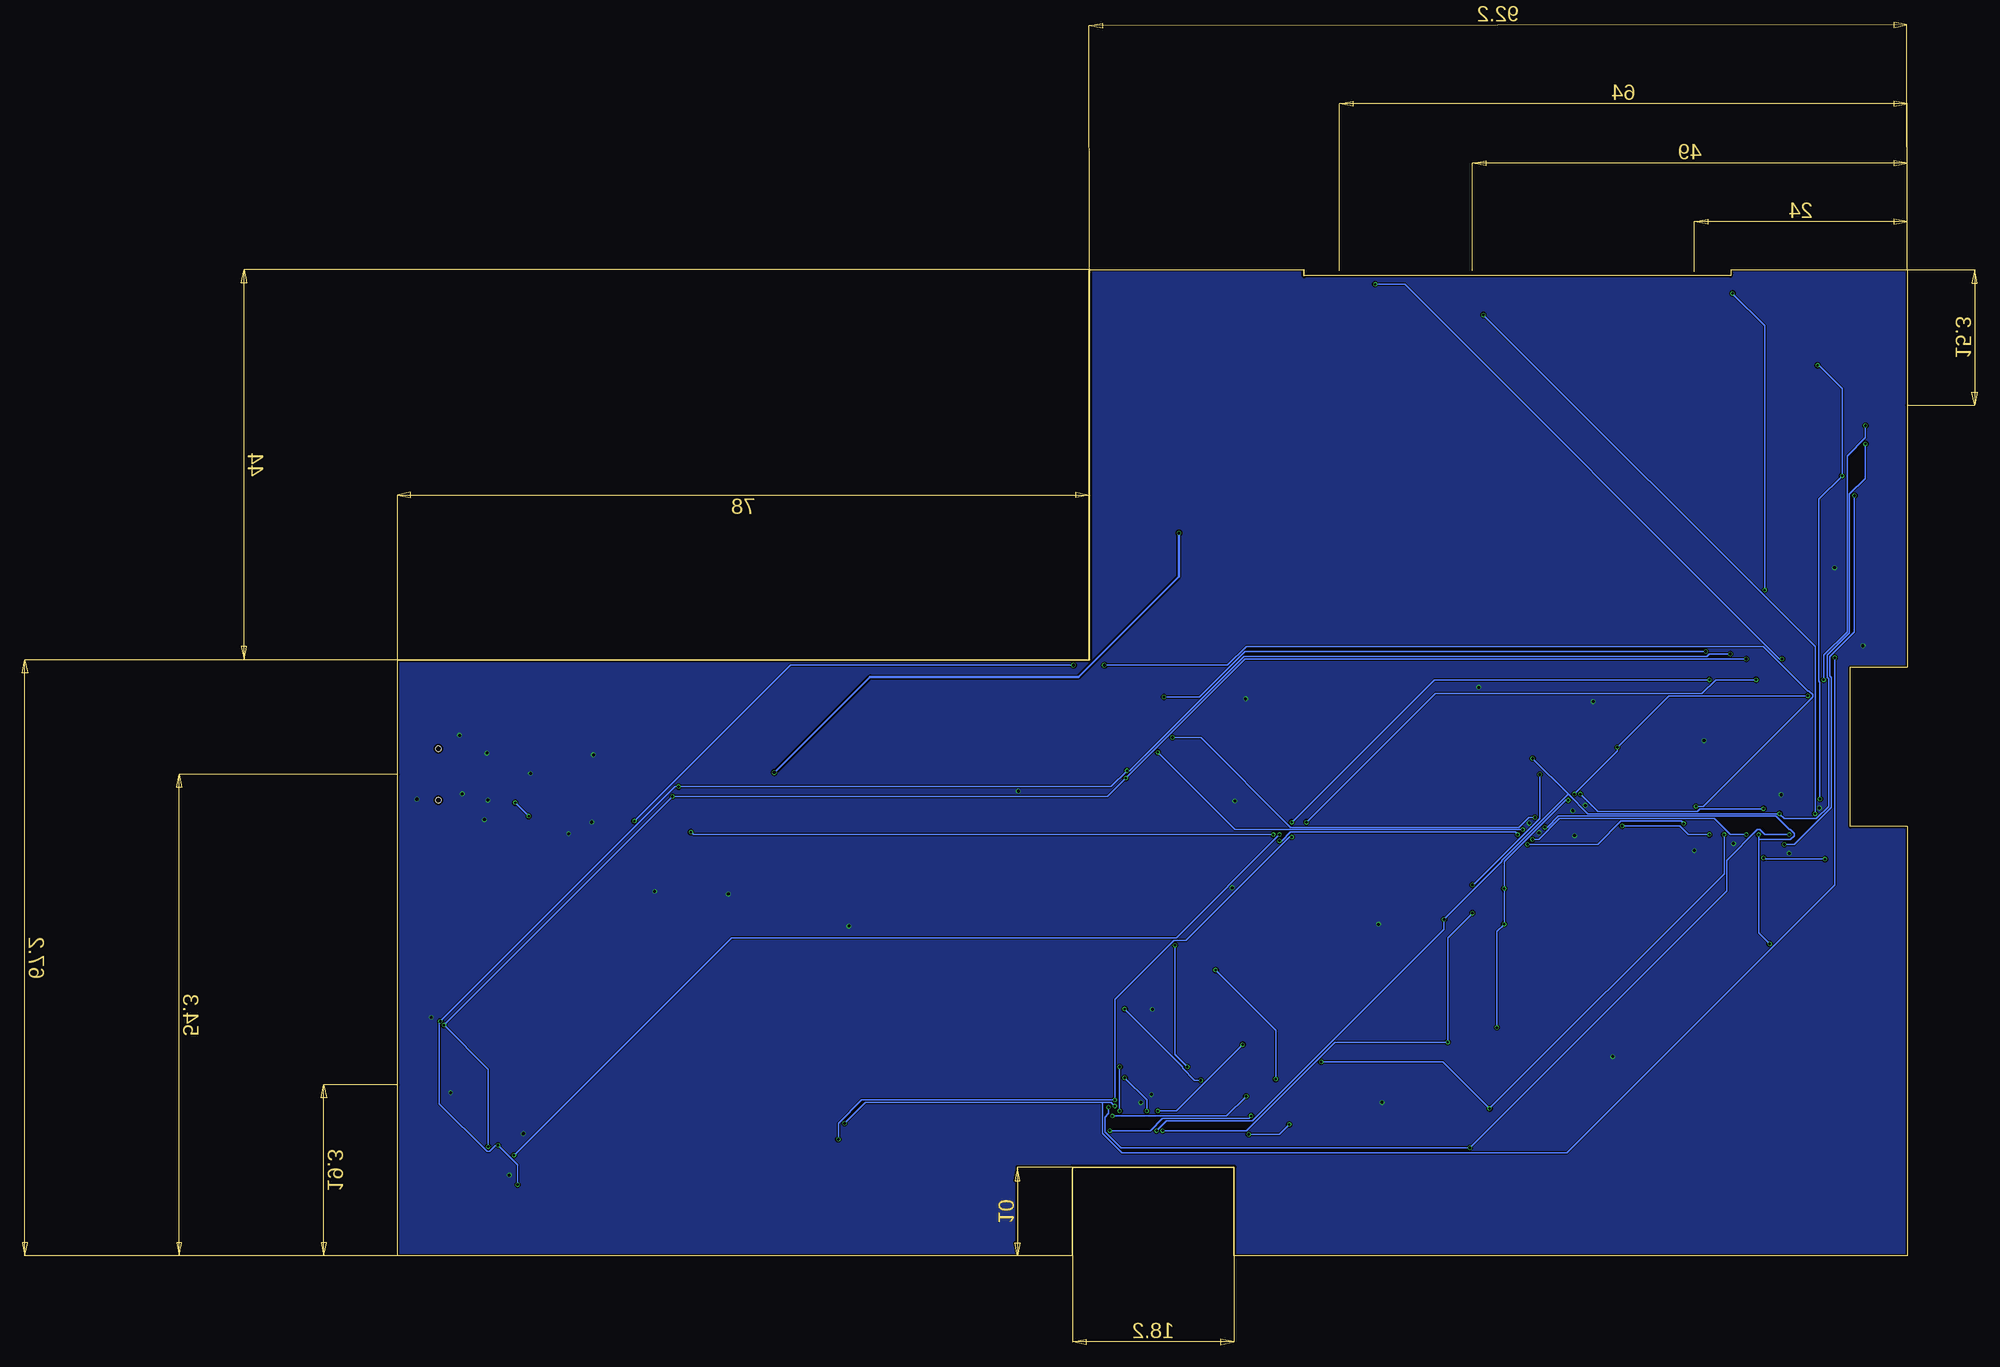
[diagram p2: board, bottom side, seen from below]

Size 170.2 x 111.2 mm. Coordinates in mm from the lower left corner, seen from the top.
Outline: 92.2,111.2 68,111.2 68,110.5 19.9,110.5 19.9,111.2 0,111.2 0,66.4 6.4,66.4 6.4,48.4 0,48.4 0,0 75.9,0 75.9,10 94.1,10 94.1,0 170.2,0 170.2,67.2 92.2,67.2 92.2,111.2
Copper layers (1*16): Top 0.035mm / dielectric 1.6mm / Bottom 0.035mm
Design rules "jlcpcb-2layers.dru *": minimum track width 0.12mm, minimum drill 0.3mm, track to track 5mil, track to pad 5mil, pad to pad 5mil, via to via 5mil, smd to smd 5mil, copper to edge 0.2mm, drill to drill 6mil, minimum pad ring 10mil, minimum via ring 3mil, stop-mask expansion 4mil, vias tented up to drill 0mil, thermal gap 10mil

### Footprints (pad centres in the part's own frame; a part is rotated, then mirrored left to right if it is on the bottom)
MYBUTTON = smd 1.4 x 1.05: 1 1.75,0.75; 2 -1.75,0.75; 3 -1.75,-0.75; 4 1.75,-0.75
EAGLE-LTSPICE_C0402 = smd 0.7 x 0.9: 1 -0.65,0; 2 0.65,0
RCL_CT3528 = smd 2 x 2.2: + -1.5,0; - 1.5,0
CAPCP3225X100N = smd 1.4 x 1.4: 1 -1.1,0; 2 1.1,0
ADAFRUIT_CHIP-LED0603 = smd 0.8 x 0.8: A 0,-0.75; C 0,0.75
SOT95P280X145-6N = smd 1.2 x 0.6: 1 -1.25,0.95; 2 -1.25,0; 3 -1.25,-0.95; 4 1.25,-0.95; 5 1.25,0; 6 1.25,0.95
ESP32_WROVER_AVX---SD0805S020S1R0_AVX_SD0805S020S1R0_0 = smd 0.8 x 0.9: 1 -1.05,0; 2 1.05,0
SOD3716X135N = smd 1.15 x 0.8: 1 -1.75,0; 2 1.75,0
DIOC1608X36N = smd 0.97 x 0.94: 1 -0.75,0; 2 0.75,0
SOT95P280X125-5N = smd 0.9 x 0.6: 1 -1.4,0.95; 2 -1.4,0; 3 -1.4,-0.95; 4 1.4,-0.95; 5 1.4,0.95
SOT95P280X120-5N = smd 0.9 x 0.6: 1 -1.4,0.95; 2 -1.4,0; 3 -1.4,-0.95; 4 1.4,-0.95; 5 1.4,0.95
FH34SRJ24S05SH99 = smd 0.3 x 0.8: 1 5.75,1.45; 2 5.25,1.45; 3 4.75,1.45; 4 4.25,1.45; 5 3.75,1.45; 6 3.25,1.45; 7 2.75,1.45; 8 2.25,1.45; 9 1.75,1.45; 10 1.25,1.45; 11 0.75,1.45; 12 0.25,1.45; 13 -0.25,1.45; 14 -0.75,1.45; 15 -1.25,1.45; 16 -1.75,1.45; 17 -2.25,1.45; 18 -2.75,1.45; 19 -3.25,1.45; 20 -3.75,1.45; 21 -4.25,1.45; 22 -4.75,1.45; 23 -5.25,1.45; 24 -5.75,1.45 | smd 0.4 x 0.8: MP1 6.75,-1.05; MP2 -6.75,-1.05
SAMACSYS_PARTS_USB4110GFA = smd 0.3 x 1.15: A1 -3.35,3.678; A4 -2.55,3.678; A5 -1.25,3.678; A6 -0.25,3.678; A7 0.25,3.678; A8 1.25,3.678; A9 2.55,3.678; A12 3.35,3.678; B1 3.05,3.678; B4 2.25,3.678; B5 1.75,3.678; B6 0.75,3.678; B7 -0.75,3.678; B8 -1.75,3.678; B9 -2.25,3.678; B12 -3.05,3.678 | smd 2.18 x 2: MP1 -5.11,-0.827; MP2 5.11,-0.827; MP3 -5.11,3.103; MP4 5.11,3.103 | hole 0.65: -2.89,2.603; 2.89,2.603
JST04_1MM_RA = smd 0.6 x 1.35: 1 -1.5,0; 2 -0.5,0; 3 0.5,0; 4 1.5,0 | smd 1.2 x 2: NC1 2.8,-3.675; NC2 -2.8,-3.675
112ATAARR03ATTEND = smd 1.8 x 1.2: G1 10.6,10.4; G2 4.9,10.4; S1 7.75,10.4; S2 2.05,10.4 | smd 1.4 x 1.9: G3 13.6,-3.85; G4 0.45,-2.85 | smd 0.7 x 1.5: P1 8.8,0; P2 7.7,0.4; P3 6.6,0; P4 5.5,-0.2; P5 4.4,0; P6 3.3,-0.2; P7 2.2,0; P8 1.1,0
IND_4828-WE-TPC_WRE = smd 0.127 x 0.127: 1 -2.286,0; 2 2.286,0
ESP32C6_VARISTOR_CT/CN1812 = smd 1.5 x 3.6: 1 -2.25,0; 2 2.25,0
ESP32_WROVER_SPARKFUN-DISCRETESEMI_SOT23-3 = smd 0.8 x 0.9: 1 -0.95,-1; 2 0.95,-1; 3 0,1.1
SOT65P210X110-3N = smd 1.05 x 0.5: 1 -1.05,0.65; 2 -1.05,-0.65; 3 1.05,0
ESP32_WROVER_EAGLE-LTSPICE_R0402 = smd 0.7 x 0.9: 1 -0.65,0; 2 0.65,0
ESP32_WROVER_BME680_PSON80P300X300X100-8N = smd 1.016 x 0.5: 1 1.458,1.2; 2 1.458,0.4; 3 1.458,-0.4; 4 1.458,-1.2; 5 -1.458,-1.22; 6 -1.458,-0.4; 7 -1.458,0.4; 8 -1.458,1.2
SJ = smd 1.168 x 1.6: 1 -0.762,0; 2 0.762,0
TP20R = smd 2 x 2: TP 0,0
SON127P600X800X80-9N = smd 0.94 x 0.44: 1 -3.895,1.905; 2 -3.895,0.635; 3 -3.895,-0.635; 4 -3.895,-1.905; 5 3.895,-1.905; 6 3.895,-0.635; 7 3.895,0.635; 8 3.895,1.905 | smd 3.4 x 4.3: 9 0,0
XCVR_ESP32-C6-WROOM-1-N8 = smd 1.5 x 0.9: 1 -8.75,5.26; 2 -8.75,3.99; 3 -8.75,2.72; 4 -8.75,1.45; 5 -8.75,0.18; 6 -8.75,-1.09; 7 -8.75,-2.36; 8 -8.75,-3.63; 9 -8.75,-4.9; 10 -8.75,-6.17; 11 -8.75,-7.44; 12 -8.75,-8.71; 13 -8.75,-9.98; 14 -8.75,-11.25; 15 8.75,-11.25; 16 8.75,-9.98; 17 8.75,-8.71; 18 8.75,-7.44; 19 8.75,-6.17; 20 8.75,-4.9; 21 8.75,-3.63; 22 8.75,-2.36; 23 8.75,-1.09; 24 8.75,0.18; 25 8.75,1.45; 26 8.75,2.72; 27 8.75,3.99; 28 8.75,5.26 | smd 0.8 x 0.8: 29_1 -2.755,0.79; 29_2 -1.505,0.79; 29_3 -0.255,0.79; 29_4 -2.755,-0.46; 29_5 -1.505,-0.46; 29_6 -0.255,-0.46; 29_7 -2.755,-1.71; 29_8 -1.505,-1.71; 29_9 -0.255,-1.71
SOIC127P1032X265-16N = smd 2.05 x 0.59: 1 -4.655,4.445; 2 -4.655,3.175; 3 -4.655,1.905; 4 -4.655,0.635; 5 -4.655,-0.635; 6 -4.655,-1.905; 7 -4.655,-3.175; 8 -4.655,-4.445; 9 4.655,-4.445; 10 4.655,-3.175; 11 4.655,-1.905; 12 4.655,-0.635; 13 4.655,0.635; 14 4.655,1.905; 15 4.655,3.175; 16 4.655,4.445
SON50P200X200X80-9N = smd 0.76 x 0.27: 1 -0.985,0.75; 2 -0.985,0.25; 3 -0.985,-0.25; 4 -0.985,-0.75; 5 0.985,-0.75; 6 0.985,-0.25; 7 0.985,0.25; 8 0.985,0.75 | smd 0.9 x 1.3: 9 0,0
ESP32_WROVER_SPARKFUN-IC-POWER_SOT23-5 = smd 0.55 x 1.2: 1 -0.95,-1.3; 2 0,-1.3; 3 0.95,-1.3; 4 0.95,1.3; 5 -0.95,1.3

### Placement (x,y rotation side)
BOOT_BUTTON  23.97,108.91 180 top
C1  159.97,6.55 90 top
C1_BAT  119.16,50.75 180 top
C1_BAT1  118.23,39.08 90 top
C1_BAT2  132.33,38.72 90 top
C2  158.87,6.55 90 top
C2_BAT  132.15,50.75 270 top
C3  129.2,37.81 90 top
C4  93.31,32.91 90 top
C4_USB  156.24,45.83 180 top
C5  45.81,108.28 270 top
C5_USB  156.23,47.03 180 top
C6  20.73,108.28 270 top
C7  80.6,26.93 0 top
C8  91.17,52.89 90 top
C9  8.43,101.99 270 top
C10  67.23,108.28 270 top
C10_SUPERCAP  93.54,53.21 270 top
C_DELAY  52.49,104.83 270 top
CHANGE_BUTTON  64.02,108.91 180 top
CHG_LED  123.05,50.77 90 top
D1  155.6,49.47 0 top
D2  119.92,39.14 90 top
D3  89.93,32.28 0 top
D4  89.93,28.72 180 top
D5  81.09,35.92 180 top
D6  75.2,24.77 0 top
D7  86.41,48.42 180 top
D8  9.32,99.43 180 top
D9  30.55,58.93 180 top
D10  51.47,40.96 270 top
D11  49.87,40.98 270 top
D12  46.28,41.05 270 top
EPD_C1  90.25,22.78 90 top
EPD_C2  88.85,22.79 90 top
EPD_C5  87.41,22.75 90 top
EPD_C6  85.75,22.7 90 top
EPD_C7  84.35,22.71 90 top
EPD_C8  82.95,22.72 90 top
EPD_C9  81.55,22.73 90 top
EPD_C10  80.11,22.71 90 top
EPD_C11  69.89,13.89 0 top
EPD_C12  72.01,12.85 90 top
IC1  49.17,104.47 0 top
IC4  124.51,38.97 0 top
J1  84.97,13.57 0 top
J2  168.17,54.29 90 top
J3  165.32,19.3 90 top
J4  5.82,95.96 270 top
L1  81.15,31.23 270 top
PFMF.050.1  154.76,43.2 180 top
Q1  134.22,47.46 0 top
Q2  76.46,27.79 270 top
Q3  71.22,17.94 90 top
R1  9.11,46.09 270 top
R1_BAT  122.84,49.55 180 top
R1_PINH  156.59,6.55 270 top
R1_PINH1  86.96,63.94 0 top
R1_PWRUSB  121.15,36.36 180 top
R2  75.29,19.42 90 top
R2-PINH1  91.31,62.73 90 top
R2-USB  150.93,49.61 270 top
R2-USB1  158.33,52.6 90 top
R2_BAT  125.17,46.38 90 top
R2_PINH  157.72,6.55 270 top
R3  74.17,19.42 90 top
R4  74.42,16.61 0 top
R5  32.29,51.05 90 top
R6  51.31,37.73 270 top
R7  49.91,37.71 270 top
R8  46.29,37.81 90 top
R9  72.29,27.87 90 top
R10  10.09,101.99 90 top
R_BOOT  27.13,108.28 90 top
R_CAPACITOR  86.35,50.04 0 top
R_CHANGE  60.86,108.28 90 top
R_CL1  73.97,27.87 90 top
R_RESET  52.21,108.28 90 top
RESET_BUTTON  49.02,108.91 180 top
SENSOR2  158.38,11.94 90 top
SJ1  69.64,12.11 180 top
TP1  14.11,76.49 0 top
TP2  16.73,76.39 0 top
TP3  82.15,88.19 0 top
TP4  73.27,91.29 0 top
TP5  82.19,91.29 0 top
TP6  46.21,24.39 0 top
TP7  50.33,24.39 0 top
TP8  47.65,51.29 0 top
TP9  121.07,14.39 0 top
TP10  48.12,15.61 0 top
TP11  48.09,12.79 0 top
TP12  121.07,11.81 0 top
TP13  67.92,36.21 0 top
TP14  155.97,58.91 0 top
TP15  16.52,34.21 0 top
TP16  20.99,34.19 0 top
TP17  87.54,18.79 0 top
U1  37.5,56.86 0 top
U2  13.1,57.44 90 top
U3  83.8,57.15 270 top
U4  137.38,51.62 0 top
U5  126.41,49.99 90 top

### Tracks (layer width: path | path; a pad name or v marks a point on that pad's centre or on a via)
3V3
  Top 0.3: 166.37,28.3 166.37,60.58
  Top 0.305: 20.59,34.66 20.59,34.59 TP16.TP | R5.2 32.29,54.91 U1.3 35.21,57.83 35.21,58.82 35.68,59.29 39.6,59.29 U1.7 U1.8 | R5.2 31.49,50.9 31.49,44.7 TP16.TP | R5.2 32.39,51.7 33.07,51.02 33.07,49.75 44.36,38.46 R8.2 48.41,38.46 49.81,37.06 R7.2 49.93,37.08 R6.2 51.41,37.08 59.97,28.52 R9.2 72.57,28.52 73.87,27.22 R_CL1.1 74.07,27.22 74.64,27.79 Q2.3 77.26,28.09 77.26,47.9 77.56,48.2 | 77.56,48.2 77.56,52.37 80.57,55.39 80.96,55.39 86.97,61.4 U3.2 87.61,62.44 R1_PINH1.2 90.65,63.94 91.21,63.38 R2-PINH1.2 102.3,63.38 125.76,39.92 IC4.5 125.91,39.5 129.1,36.31 C3.+ 130.47,36.31 132.23,38.07 | TP16.TP 20.59,34.66 | 20.59,34.66 20.59,35.16 9.61,46.14 9.11,46.14 R1.1 U2.2 9.11,63.22 7.09,65.24 7.09,75.18 4.79,77.49 4.79,90.46 J4.P4 6.53,90.46 7.25,91.17 7.25,101.56 8.33,102.64 C9.1 R10.2 22.82,102.64 27.13,106.95 R_BOOT.1 30.29,104.47 IC1.2 48.27,104.47 50.7,106.9 52.2,106.9 52.21,106.91 R_RESET.1 R_CHANGE.1 | J3.2 164.95,18.8 164.37,19.38 164.37,26.3 166.37,28.3 | 166.37,60.58 166.19,60.77 149.35,60.77 136.2,47.62 133.18,47.62 131.6,46.04 131.6,38.7 132.23,38.07 | 132.23,38.07 C1_BAT2.1 | D7.2 77.78,48.42 77.56,48.2
32KHZ  (via drill 0.3)
  Top 0.15: R2-PINH1.1 91.27,62.19 88.5,62.19 88.22,61.91 U3.1 88.22,61.77 88.22,60.52 v84.48,56.78 | v18.14,47.51 18,47.64 18,48.61 U2.9 | v43.35,48.06 v42.24,46.95
  Bottom 0.15: v18.14,47.51 19.94,47.51 21.74,49.31 39.2,49.31 41.55,46.95 v42.24,46.95 | v43.35,48.06 75.76,48.06 v84.48,56.78
DN  (via drill 0.3)
  Top 0.15: J2.A7 164.54,54.43 165.23,54.43 165.37,54.29 165.37,53.88 165.09,53.6 164.54,53.6 J2.B7 164.4,53.6 163.84,53.6 163.57,53.88 157.75,53.88 156.92,53.05 v156.92,51.11 | v155.4,49.58 156.37,48.61 156.78,48.61 D1.4
  Bottom 0.15: v156.92,51.11 v155.4,49.58
DP
  Top 0.15: 163.71,54.29 163.84,54.15 164.4,54.15 J2.A6 | 163.71,54.29 163.71,54.85 163.84,54.98 164.4,54.98 J2.B6 | 163.71,54.29 157.75,54.29 156.37,52.91 156.37,50.97 156.78,50.55 D1.6
EPD_3V3
  Top 0.305: 87.31,22.1 83.72,18.51 J1.15 J1.16 | TP17.TP 87.41,18.92 EPD_C5.1 87.31,22.1 | C7.1 79.95,26.83 80.91,25.87 84.93,25.87 86.68,24.11 86.68,22.73 87.31,22.1 | L1.2 81.15,28.13 C7.1 | Q2.2 79.86,26.84 C7.1
EPD_3V3_C
  Top 0.305: Q2.1 75.24,28.52 R_CL1.2 73.87,28.52 67.92,34.47 TP13.TP 40.89,63.24 22.97,63.24 20.54,65.67 U2.18
EPD_BUSY  (via drill 0.3)
  Top 0.15: v89.33,16.9 87.81,16.9 86.7,15.79 86.7,15.1 J1.9 | v119.8,14.96 119.94,14.82 120.08,14.82 120.5,14.4 121.05,14.4 TP9.TP | v8.17,67.45 10.11,67.45 10.39,67.17 10.39,66.2 U2.26
  Bottom 0.15: v89.33,16.9 89.75,17.31 90.72,17.31 | 90.72,17.31 117.45,17.31 v119.8,14.96 | v8.17,67.45 8.17,41.83 38.36,11.63 88.5,11.63 90.72,13.85 90.72,17.31
EPD_CS  (via drill 0.3)
  Top 0.15: v84.48,16.34 85.18,15.65 85.18,15.1 J1.12 | v74.93,23.82 74.51,24.24 74.51,24.65 D6.1 74.37,24.79 74.37,25.21 73.13,26.45 73.13,27.15 72.99,27.29 72.3,27.29 R9.1 72.16,27.29 71.47,27.29 v66.06,21.88 | v20.64,47.51 20.64,48.61 U2.11 | v47.09,16.62 48.06,15.65 TP10.TP
  Bottom 0.15: v84.48,16.34 82.41,16.34 v74.93,23.82 | v20.64,47.51 20.64,43.07 v47.09,16.62 52.35,21.88 v66.06,21.88
EPD_DC  (via drill 0.3)
  Top 0.15: v85.73,16.34 85.73,15.1 J1.11 | v88.22,20.08 90.03,18.28 v90.03,16.76 | v49.31,12.19 48.75,12.74 48.2,12.74 TP11.TP | v13.3,47.51 13.16,47.51 13.02,47.64 13.02,48.61 U2.5
  Bottom 0.15: v85.73,16.34 85.73,17.59 v88.22,20.08 | v90.03,16.76 90.03,16.07 90.44,15.65 90.44,13.99 88.64,12.19 v49.31,12.19 20.36,41.13 20.36,44.6 16.9,48.06 16.62,48.06 16.07,47.51 v13.3,47.51
EPD_RST  (via drill 0.3)
  Top 0.15: v89.33,17.59 89.19,17.45 87.95,17.45 86.28,15.79 86.28,15.1 J1.10 | v120.5,13.16 121.05,12.6 121.05,11.91 TP12.TP | v17.04,64.96 16.76,65.23 16.76,66.06 U2.21 | v69.39,47.23 v67.73,48.89
  Bottom 0.15: v120.5,13.16 120.5,14.96 117.86,17.59 v89.33,17.59 89.33,28.95 82.68,35.59 81.3,35.59 69.67,47.23 v69.39,47.23 | v17.04,64.96 21.61,64.96 23.13,63.43 53.18,63.43 v67.73,48.89
FLASH_CS  (via drill 0.3)
  Top 0.15: 31.44,58.72 33.52,58.72 U1.1 | 31.44,58.72 31.3,58.86 D9.1 31.44,58.72 | v32.13,48.48 32.27,48.61 32.27,50.28 R5.1 | v22.3,47.51 21.88,47.92 21.88,48.61 U2.12 21.88,48.75 21.88,49.44 23.68,51.24 24.24,51.24 31.44,58.45 31.44,58.72
  Bottom 0.15: v32.13,48.48 25.62,48.48 24.65,47.51 v22.3,47.51
GDR  (via drill 0.3)
  Top 0.15: v89.89,14.13 90.03,14.13 90.3,14.4 90.3,14.96 J1.2 | R4.1 73.82,16.48 73.96,16.34 v73.96,15.79 70.91,15.79 70.64,16.07 70.64,16.76 Q3.1
  Bottom 0.15: v89.89,14.13 85.32,14.13 83.93,15.51 74.24,15.51 v73.96,15.79
GND  (via drill 0.35)
  Top 0.152: J3.1 164.8,17.8 v164.2,18.4 | U2.29_4 U2.29_5 | J2.B12 J2.A1
  other vias: 157.6,9.1 156,13.8 160,51.4 162.9,52.1 160.4,49.2 168,51.5 5,68.8 13.3,45.4 24,45.7 35.4,62.5 148.1,56.5 155.2,54.4 141.2,41.1 163.2,58.7 119.3,37.2 132.9,40.8 150.9,47.6 148.3,48.9 160.1,56.7 166.4,26.9 74.6,62.8 8.2,77.6 75.8,51.3 100.2,52.4 48.3,64.1 22.9,58.1 14.2,52 59.6,37.4 85.1,27.8 33.2,22.5 59.2,17.3 19.6,46.5 9.9,50.5 37.5,47.4 37.7,50.2 36.3,50.8 42.6,48.8 41.5,47.7 76.1,41.5 86.4,17.3 85.2,18.2
  pour Top: 6.44,66.42 6.44,48.38 6.42,48.36 0.04,48.36 0.04,0.04 75.86,0.04 75.86,10.02 75.88,10.04 94.12,10.04 94.14,10.02 94.14,0.04 170.16,0.04 170.16,67.16 92.18,67.16 92.16,67.18 92.16,111.16 68.04,111.16 68.04,110.48 68.02,110.46 19.88,110.46 19.86,110.48 19.86,111.16 0.04,111.16 0.04,66.44 6.42,66.44
  pour Bottom: 6.44,66.42 6.44,48.38 6.42,48.36 0.04,48.36 0.04,0.04 75.86,0.04 75.86,10.02 75.88,10.04 94.12,10.04 94.14,10.02 94.14,0.04 170.16,0.04 170.16,67.16 92.18,67.16 92.16,67.18 92.16,111.16 68.04,111.16 68.04,110.48 68.02,110.46 19.88,110.46 19.86,110.48 19.86,111.16 0.04,111.16 0.04,66.44 6.42,66.44
GPIO8  (via drill 0.3)
  Top 0.15: v9.28,44.74 9.14,44.87 9.14,45.43 R1.2 | v16.2,44.87 19.25,47.92 19.25,48.61 U2.10
  Bottom 0.15: v9.28,44.74 16.07,44.74 v16.2,44.87
I2C_PW  (via drill 0.3)
  Top 0.15: C1.1 159.97,5.96 159,5.96 C2.1 158.86,5.96 157.75,5.96 R2_PINH.2 157.61,5.96 156.64,5.96 R1_PINH.2 156.5,5.96 155.81,5.96 155.67,6.09 155.67,8.31 157.2,9.83 157.2,10.39 SENSOR2.8 157.2,10.53 157.2,11.22 | 157.2,11.22 157.47,11.49 158.03,11.49 | 158.03,11.49 158.44,11.49 158.72,11.22 158.72,10.53 SENSOR2.6 | 158.03,11.49 158.03,13.3 SENSOR2.2 | v22.3,64.96 22.16,64.96 21.88,65.23 21.88,66.06 U2.17 | v70.77,47.51 v69.39,48.89 | 157.2,11.22 v157.06,11.36
  Bottom 0.15: v22.3,64.96 53.32,64.96 v69.39,48.89 | v70.77,47.51 82.41,35.87 132.54,35.87 v157.06,11.36
INT_RTC  (via drill 0.3)
  Top 0.15: R1_PINH1.1 86.28,63.85 86.28,63.57 85.73,63.02 85.73,61.91 U3.3 85.59,61.77 85.59,61.22 v82.82,58.45 | v16.76,47.51 16.76,48.61 U2.8 | v15.51,35.18 16.48,34.21 TP15.TP | v40.86,48.34 v41.97,49.44
  Bottom 0.15: 16.76,46.95 16.76,36.42 v15.51,35.18 | 16.76,46.95 v16.76,47.51 | v82.82,58.45 79.64,58.45 69.53,48.34 43.77,48.34 42.66,49.44 v41.97,49.44 | v40.86,48.34 40.58,48.34 39.33,49.58 14.82,49.58 13.3,48.06 13.16,48.06 12.74,47.64 12.74,47.37 13.16,46.95 16.76,46.95
IO/BOOT  (via drill 0.3)
  Top 0.15: R_BOOT.2 26.41,109.66 BOOT_BUTTON.3 BOOT_BUTTON.4 21.45,109.66 C6.1 20.64,108.93 20.22,108.93 19.8,108.52 v19.71,108.52 | v16.07,75.07 16.2,74.93 16.62,74.93 24.38,67.17 24.38,66.2 U2.15
  Bottom 0.15: v16.07,75.07 16.07,104.88 v19.71,108.52
IO/CHANGE  (via drill 0.3)
  Top 0.15: v14.13,67.31 14.27,67.17 14.27,66.2 U2.23 | 62.33,109.69 CHANGE_BUTTON.4
  Top 0.305: C10.1 66.67,108.93 65.94,109.66 CHANGE_BUTTON.3 62.36,109.66 62.33,109.69 CHANGE_BUTTON.4 62.17,109.74 61.37,108.93 R_CHANGE.2 60.76,108.93 60.14,109.55 v59.97,109.55
  Bottom 0.15: v14.13,67.31 14.4,67.31 56.65,109.55 v59.97,109.55
MISO  (via drill 0.3)
  Top 0.15: v45.43,37.4 45.57,37.26 46.26,37.26 R8.1 | v45.43,41.41 45.84,41.83 46.26,41.83 D12.1 | v32.69,57.34 32.83,57.48 33.52,57.48 U1.2 | v38.23,51.38 v37.53,52.08 | v11.22,63.16 v9.42,64.96 9.14,65.23 9.14,66.06 U2.27 | v4.71,93.63 4.85,93.76 5.68,93.76 J4.P7 | v46.26,25.76 46.26,24.52 TP6.TP
  Bottom 0.15: v37.53,52.08 32.69,56.92 v32.69,57.34 26.87,63.16 v11.22,63.16 | v38.23,51.38 38.5,51.38 45.43,44.46 v45.43,41.41 v45.43,37.4 46.26,36.56 v46.26,25.76 | v4.71,93.63 4.71,92.24 6.79,90.16 6.79,70.36 9.42,67.73 v9.42,64.96
MOSI  (via drill 0.3)
  Top 0.15: v83.93,14.13 84.21,14.4 84.21,14.96 J1.14 | v51.8,24.1 51.52,24.38 50.41,24.38 TP7.TP | 49.17,41.41 49.44,41.69 49.86,41.69 D11.1 | 49.17,41.41 48.89,41.13 48.89,38.78 v49.03,38.64 49.31,38.36 49.86,38.36 R7.1 | v49.03,41.83 49.03,41.55 49.17,41.41 | U1.5 41.41,54.85 v41.41,54.29 41.27,54.15 38.92,54.15 v36.84,52.08 | v16.2,50.41 15.51,49.72 15.51,48.75 U2.7 15.37,48.61 15.37,47.92 v13.85,46.4 | v5.96,85.73 7.89,87.67 7.89,88.36 6.79,89.47 5.82,89.47 J4.P3
  Bottom 0.15: v83.93,14.13 74.51,14.13 64.54,24.1 v51.8,24.1 51.8,35.87 v49.03,38.64 | v41.41,54.29 41.41,49.31 48.89,41.83 v49.03,41.83 | v16.2,50.41 23.41,50.41 23.68,50.14 34.9,50.14 v36.84,52.08 | v5.96,85.73 5.96,70.36 8.73,67.59 8.73,65.37 8.59,65.23 8.59,50.55 12.74,46.4 v13.85,46.4
N$1  (via drill 0.3)
  Top 0.15: v88.78,16.34 88.78,15.1 J1.5 | v88.78,21.33 88.78,22.02 EPD_C2.1
  Bottom 0.15: v88.78,21.33 v88.78,16.34
N$2
  Top 0.305: R_CAPACITOR.2 87,48.93 87.48,48.45 D7.1
N$3
  Top 0.15: IC1.5 50.69,105.4 52.35,105.4 C_DELAY.1
N$4
  Top 0.15: J1.4 89.19,15.1 89.19,15.51 89.06,15.65 89.06,15.93 89.47,16.34 89.75,16.34 89.89,16.2 90.16,16.2 90.58,16.62 90.58,21.47 90.3,21.74 90.3,22.02 EPD_C1.1
N$5
  Top 0.15: J1.18 82.27,15.1 82.27,18.28 85.73,21.74 85.73,22.02 EPD_C6.1
N$6
  Top 0.15: J1.19 81.72,15.1 81.72,19.11 84.35,21.74 84.35,22.02 EPD_C7.1
N$8
  Top 0.15: J1.20 81.16,15.1 81.16,19.94 82.96,21.74 82.96,22.02 EPD_C8.1
N$9
  Top 0.15: D3.2 93.21,32.27 C4.1 | D3.2 91.69,28.81 D4.1 | D3.2
N$10
  Top 0.15: J1.22 80.19,15.1 80.19,22.02 EPD_C10.1
N$11
  Top 0.15: R2_BAT.2 125.2,47.09 125.2,49.03 U5.5
N$12
  Top 0.15: J1.24 79.08,14.96 76.17,14.96 73.54,12.33 72.02,12.33 EPD_C12.1
N$13
  Top 0.15: R1_BAT.1 123.54,49.58 124.23,49.58 124.37,49.72 126.31,49.72 127.14,48.89 127.56,48.89 127.7,49.03 U5.1
N$14
  Top 0.15: CHG_LED.C 122.3,50.69 122.3,49.58 R1_BAT.2
N$15
  Top 0.305: Q1.2 135.17,39.71 130.49,35.03 127.75,35.03 124.51,38.27 124.51,38.89 123.48,39.92 IC4.1 122.74,39.92 122.38,39.56 122.38,38.38 122.74,38.02 IC4.3 119.99,38.02 D2.1 119.58,38.43 C1_BAT1.1
N$16
  Top 0.15: R2-USB.1 150.97,50.28 150.97,55.68 155.54,60.25 159.69,60.25 163.84,56.09 164.4,56.09 J2.B5
N$17
  Top 0.15: R2-USB1.2 158.44,53.18 164.26,53.18 164.4,53.05 J2.A5
PREVGH  (via drill 0.3)
  Top 0.15: J1.21 80.75,15.1 80.75,20.91 v81.16,21.33 81.58,21.74 81.58,22.02 EPD_C9.1 | v82.55,35.04 82.82,35.32 82.82,35.87 D5.1
  Bottom 0.15: v82.55,35.04 82.55,22.71 v81.16,21.33
PREVGL  (via drill 0.3)
  Top 0.15: 79.64,15.79 79.78,15.65 79.78,15.1 J1.23 | 79.64,15.79 76.31,15.79 v74.24,13.71 | v69.67,14.82 69.11,14.27 69.11,13.99 EPD_C11.1 | v88.22,27.84 88.22,28.67 D4.2 | 79.64,15.79 v79.64,19.8
  Bottom 0.15: v74.24,13.71 70.77,13.71 v69.67,14.82 | v88.22,27.84 81.72,21.33 81.72,21.19 80.33,19.8 v79.64,19.8
RESE  (via drill 0.3)
  Top 0.15: v89.61,15.79 89.75,15.65 89.75,15.1 J1.3 | 74.37,18.14 74.1,18.42 74.1,18.7 R3.1 | 74.37,18.14 74.24,18 73.82,18 72.71,16.9 71.88,16.9 Q3.2 | 74.37,18.14 v74.51,18
  Bottom 0.15: v89.61,15.79 76.73,15.79 v74.51,18
RESE'
  Top 0.15: R2.2 75.21,20.08 74.24,20.08 R3.2 74.1,20.08 73.41,20.08 71.88,18.56 71.88,18.28 71.47,17.87 70.22,17.87 68.56,16.2 68.56,12.46 68.83,12.19 SJ1.2
RESET  (via drill 0.3)
  Top 0.15: 48.48,109 48.48,107.48 47.78,106.78 v47.78,106.09 47.78,105.54 IC1.1 | 48.48,109 47.92,109.55 47.37,109.55 RESET_BUTTON.4 | v10.39,49.86 10.39,48.75 U2.3 | 48.48,109 49.17,109.69 50.69,109.69 RESET_BUTTON.3
  Top 0.305: C5.1 45.91,108.93 46.94,109.97 RESET_BUTTON.4 | R_RESET.2 52.11,108.93 51.38,109.66 RESET_BUTTON.3
  Bottom 0.15: v10.39,49.86 10.39,68.7 v47.78,106.09
RTC_RST  (via drill 0.3)
  Top 0.15: v22.71,68.14 23.13,67.73 23.13,66.2 U2.16 | v83.79,63.02 83.79,62.74 84.35,62.19 84.35,61.91 U3.4
  Bottom 0.15: v22.71,68.14 74.65,68.14 79.78,63.02 v83.79,63.02
RX
  Top 0.15: U2.24 13.02,66.2 13.02,72.71 16.62,76.31 TP2.TP
SCK  (via drill 0.3)
  Top 0.15: v84.62,14.13 84.76,14.27 84.76,14.96 J1.13 | 52.08,38.09 51.8,38.36 51.38,38.36 R6.1 | 52.08,38.09 52.49,38.5 52.49,41.13 51.94,41.69 51.52,41.69 D10.1 | 52.08,38.09 v52.22,37.95 | U1.6 41.41,56.23 42.1,56.23 v42.24,56.09 46.95,51.38 47.64,51.38 TP8.TP | v14.4,49.86 14.27,49.72 14.27,48.75 U2.6 | v4.71,91.55 4.85,91.69 5.68,91.69 J4.P5
  Bottom 0.15: v84.62,14.13 83.52,15.23 73.82,15.23 52.22,36.84 v52.22,37.95 45.7,44.46 45.7,44.6 38.23,52.08 | v42.24,56.09 38.23,52.08 | 38.23,52.08 36.01,49.86 v14.4,49.86 13.85,49.31 10.25,49.31 8.86,50.69 8.86,65.09 9,65.23 9,67.73 6.51,70.22 6.51,85.87 4.71,87.67 v4.71,91.55
SCL  (via drill 0.3)
  Top 0.15: R2_PINH.1 157.75,7.2 157.75,7.76 159.41,9.42 159.97,9.42 160.38,9.83 160.38,11.91 v159.97,12.33 159.55,12.74 159.55,13.3 SENSOR2.4 | v139.19,51.8 139.05,51.94 138.5,51.94 U4.7 | v164.95,26.04 164.95,21.19 165.23,20.91 J3.4 | v18.14,67.31 18,67.17 18,66.2 U2.20 | v88.09,53.88 88.22,53.74 88.22,52.63 U3.16
  Bottom 0.15: v159.97,12.33 159.97,21.05 v164.95,26.04 v139.19,51.8 90.16,51.8 v88.09,53.88 74.65,67.31 v18.14,67.31
SDA  (via drill 0.3)
  Top 0.15: v156.64,8.03 156.64,7.2 R1_PINH.1 | v158.86,12.46 158.86,12.6 158.72,12.74 158.72,13.3 SENSOR2.3 | v138.5,52.91 138.36,52.77 138.36,52.49 U4.8 | v165.37,26.45 166.34,25.48 166.34,20.5 165.65,19.8 165.37,19.8 J3.3 | v19.94,67.86 19.25,67.17 19.25,66.2 U2.19 | v87.95,54.71 86.98,53.74 86.98,52.63 U3.15
  Bottom 0.15: v156.64,8.03 156.64,10.25 v158.86,12.46 159.14,12.46 159.83,11.77 160.11,11.77 165.51,17.17 165.51,26.32 v165.37,26.45 138.92,52.91 v138.5,52.91 89.75,52.91 v87.95,54.71 87.67,54.71 74.79,67.59 22.58,67.59 22.3,67.86 v19.94,67.86
SRC  (via drill 0.3)
  Top 0.15: 81.16,33.52 81.3,33.66 93.21,33.66 C4.2 | v71.19,19.94 71.19,19.11 Q3.3 | 79.44,33.71 v77.96,32.23 | 81.16,33.52 80.75,33.52 80.19,32.96 79.44,33.71 | 81.16,33.52 L1.1 | 79.44,33.71 79.36,33.79 79.36,35.87 D5.2
  Bottom 0.15: v71.19,19.94 71.19,25.46 v77.96,32.23
SS_SD  (via drill 0.3)
  Top 0.15: R10.1 10.11,101.24 v10.11,100.41 10.11,99.44 D8.1 | v9.83,51.52 11.63,49.72 11.63,48.75 U2.4 | v7.34,87.95 6.92,88.36 6.23,88.36 J4.P2
  Bottom 0.15: v9.83,51.52 9.83,64.68 9.97,64.82 9.97,85.32 v7.34,87.95 7.34,97.78 9.97,100.41 v10.11,100.41
TX
  Top 0.15: U2.25 11.63,66.2 11.63,73.41 13.99,75.76 13.99,76.45 TP1.TP
USB_D+  (via drill 0.3)
  Top 0.15: v137.12,47.78 138.92,49.58 151.38,49.58 152.21,50.41 154.29,50.41 D1.1 | v70.77,46.81 v71.47,47.51 | v42.8,46.4 v43.9,47.51 | v25.21,48.75 24.79,49.17 24.38,48.75 U2.14
  Bottom 0.15: v137.12,47.78 136.84,47.51 v71.47,47.51 | v70.77,46.81 70.5,46.81 69.53,47.78 44.18,47.78 v43.9,47.51 | v42.8,46.4 34.9,46.4 32.27,49.03 25.48,49.03 v25.21,48.75
USB_D-  (via drill 0.3, 0.35)
  Top 0.15: v143.49,49.03 144.18,48.34 151.52,48.34 151.66,48.48 154.29,48.48 D1.3 | v23.82,50.69 23.82,50.14 23.13,49.44 23.13,48.75 U2.13 | v90.5,66.6 v94,66.6
  Bottom 0.15: v143.49,49.03 125.9,66.62 125.88,66.6 v94,66.6 | v23.82,50.69 22.99,50.69 10.66,63.02 10.66,63.29 11.08,63.71 11.22,63.71 16.2,68.7 74.51,68.7 76.61,66.6 v90.5,66.6
VBAT  (via drill 0.35)
  Top 0.3: U4.3 U4.2
  Top 0.305: U4.3 136,51.37 134.22,49.58 Q1.3 | U4.2 136.01,51.87 132.62,51.87 C2_BAT.1 131.69,50.94 U5.3 v127.71,54.5 | v82.1,81.5 82.1,88.14 TP3.TP
  Bottom 0.305: v127.71,54.5 116.91,65.3 93.4,65.3 82.1,76.6 v82.1,81.5
VBUS
  Top 0.3: 157.73,47.98 156.88,47.13 C5_USB.1 156.89,46.91 C4_USB.1
  Top 0.305: PFMF.050.1.2 152.51,44.25 149.57,47.19 133.95,47.19 133.27,46.51 Q1.1 | 156.89,46.91 156.82,46.99 156.05,47.76 155.11,47.76 152.51,45.16 PFMF.050.1.2 | 157.73,47.98 157.73,49.11 157.37,49.47 D1.5 156.33,49.47 155.9,49.9 155.9,58.84 TP14.TP | C1_BAT.1 119.81,50.85 120.41,51.45 123.12,51.45 CHG_LED.A 123.97,50.94 U5.4 125.11,53.26 133.05,61.2 166.37,61.2 167.01,60.56 167.01,18.11 166.12,17.22 164.53,17.22 152.51,29.25 PFMF.050.1.2 | PFMF.050.1.2 152.51,42.15 144.96,34.6 122.16,34.6 120.5,36.26 R1_PWRUSB.2 119.11,36.36 117.5,37.96 117.5,38.9 117.66,39.06 118.95,39.06 119.92,40.02 D2.2
VRTC
  Top 0.305: R_CAPACITOR.1 U3.14 85.7,52.09 86.61,51.19 90.02,51.19 91.07,52.24 C8.1 91.3,52.11 C10_SUPERCAP.2
VUSB
  Top 0.3: J2.A9 J2.B4 165.16,56.54 165.8,55.9 165.8,52.5 165.34,52.04 J2.B9 J2.A4
  Top 0.305: J2.A4 163.88,51.74 163.01,50.88 163.01,50.25 157.01,44.25 PFMF.050.1.1

### Text on the board
tNames: GND | GND | VBAT | TX | RX | VBUS | SCK | EPD_3V3_C | INT_RTC | 3V3 | MISO | MOSI | EPD_3V3 | EPD_CS | EPD_BUSY | EPD_DC | EPD_RST